# EAGLE design OS-Luefters (EAGLE 6.2)

## Sheet 1 of 3
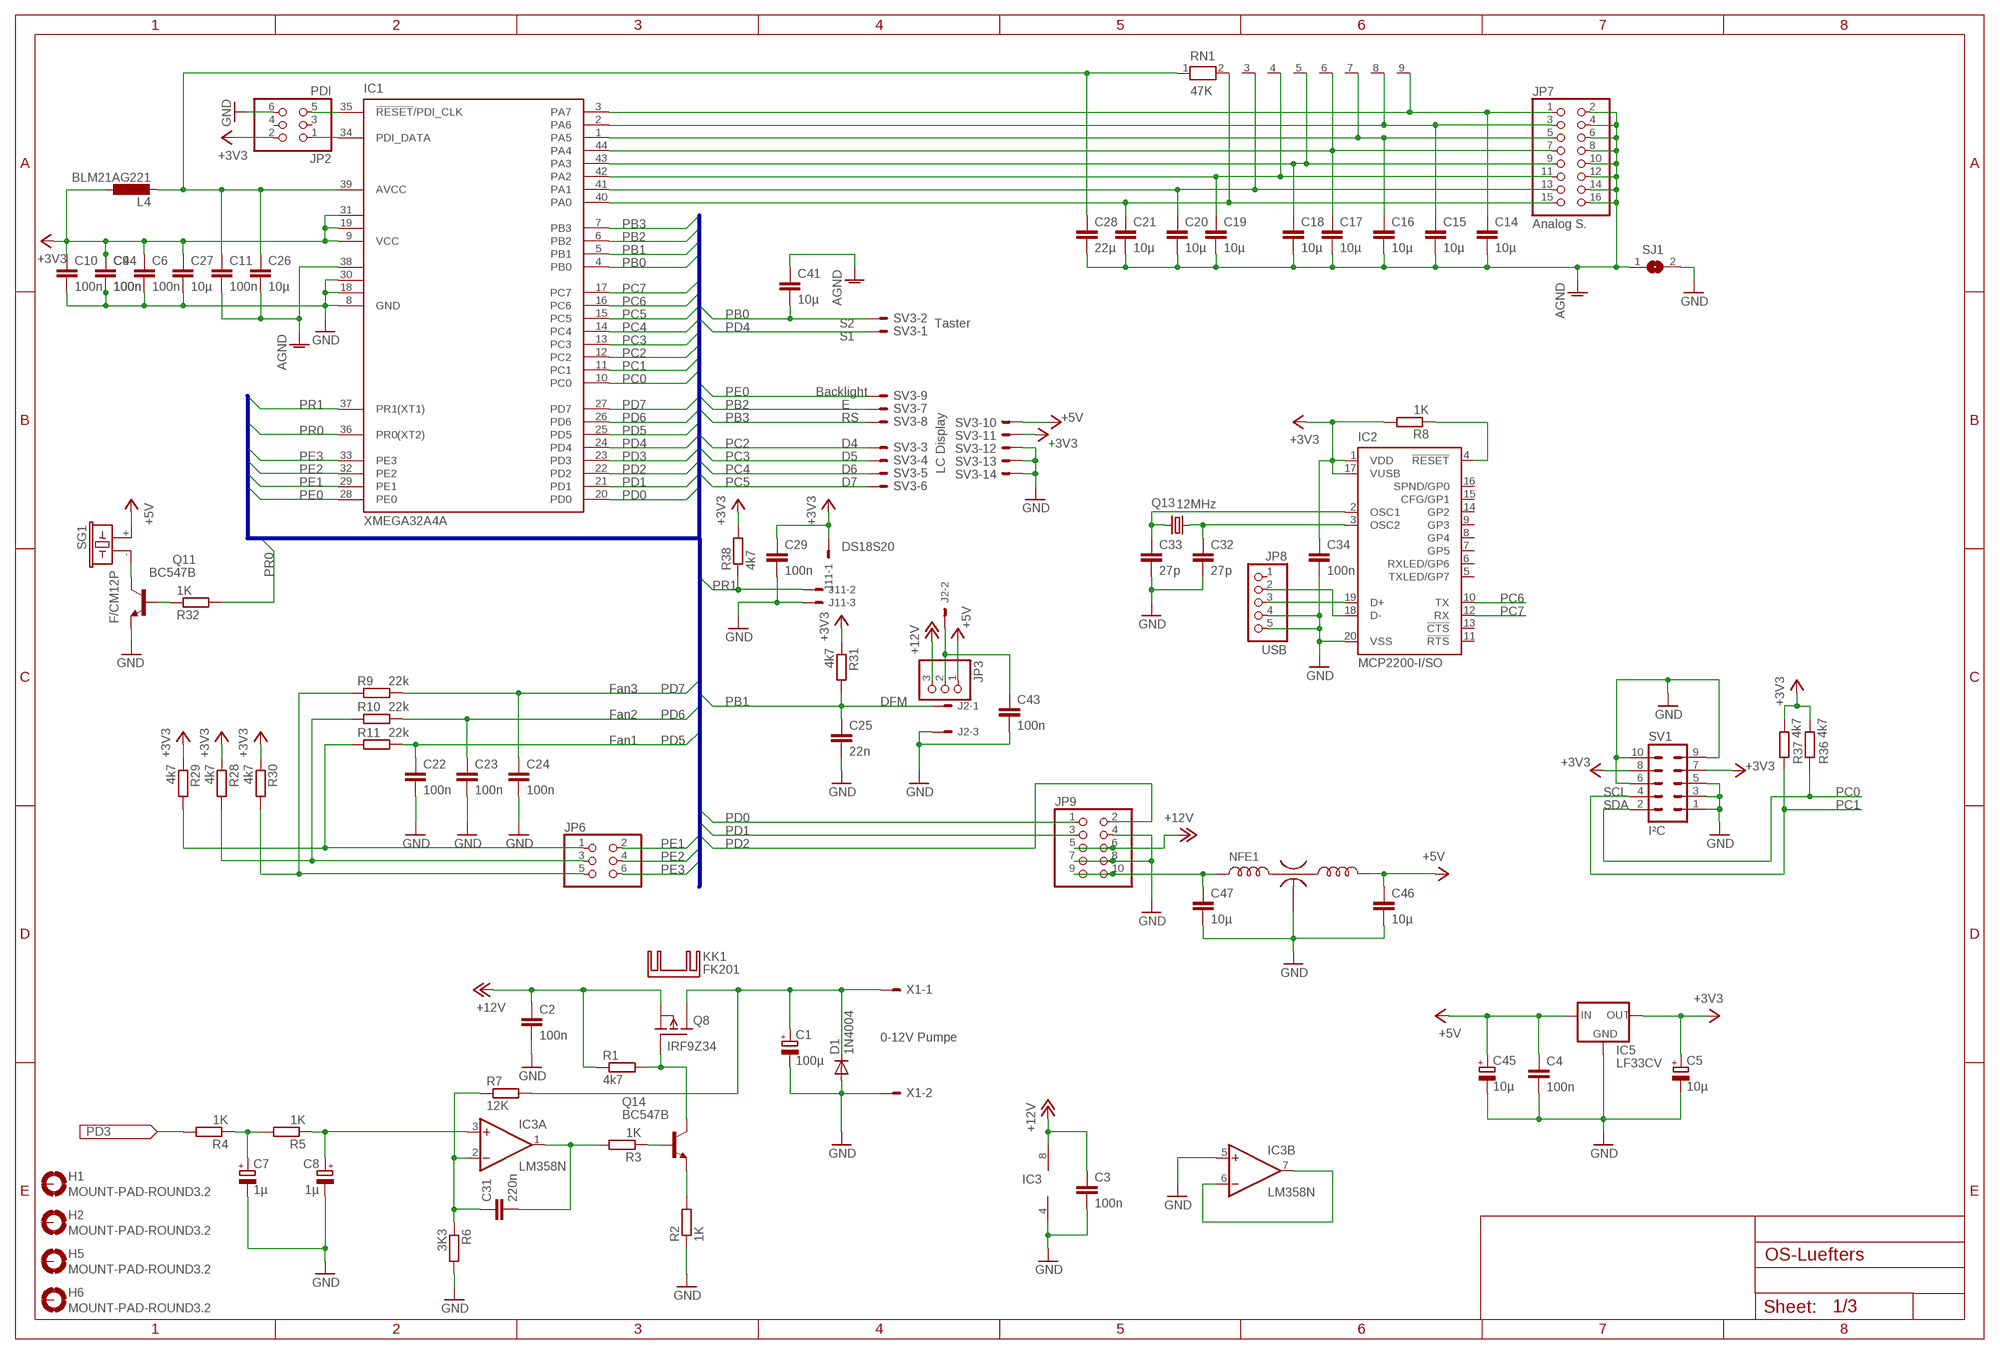
[diagram p0: schematic, sheet 1]

### Parts
C1  100µ  CPOL-EUE2.5-7  [E2,5-7]
C2  100n  C-EU050-025X075  [C050-025X075]
C3  100n  C-EU050-025X075  [C050-025X075]
C4  100n  C-EU050-025X075  [C050-025X075]
C5  10µ  CPOL-EUE2-5  [E2-5]
C6  100n  C-EUC0805K  [C0805K]
C7  1µ  CPOL-EUE2-5  [E2-5]
C8  1µ  CPOL-EUE2-5  [E2-5]
C9  100n  C-EUC0805K  [C0805K]
C10  100n  C-EUC0805K  [C0805K]
C11  100n  C-EUC0805K  [C0805K]
C14  10µ  C-EUC0805K  [C0805K]
C15  10µ  C-EUC0805K  [C0805K]
C16  10µ  C-EUC0805K  [C0805K]
C17  10µ  C-EUC0805K  [C0805K]
C18  10µ  C-EUC0805K  [C0805K]
C19  10µ  C-EUC0805K  [C0805K]
C20  10µ  C-EUC0805K  [C0805K]
C21  10µ  C-EUC0805K  [C0805K]
C22  100n  C-EU050-025X075  [C050-025X075]
C23  100n  C-EU050-025X075  [C050-025X075]
C24  100n  C-EU050-025X075  [C050-025X075]
C25  22n  C-EU050-025X075  [C050-025X075]
C26  10µ  C-EUC0805K  [C0805K]
C27  10µ  C-EUC0805K  [C0805K]
C28  22µ  C-EUC0805K  [C0805K]
C29  100n  C-EUC0805K  [C0805K]
C31  220n  C-EU050-025X075  [C050-025X075]
C32  27p  C-EU025-024X044  [C025-024X044]
C33  27p  C-EU025-024X044  [C025-024X044]
C34  100n  C-EU050-025X075  [C050-025X075]
C41  10µ  C-EUC0805K  [C0805K]
C43  100n  C-EU050-025X075  [C050-025X075]
C44  100n  C-EUC0805K  [C0805K]
C45  10µ  CPOL-EUE2-5  [E2-5]
C46  10µ  C-EUC0805K  [C0805K]
C47  10µ  C-EUC0805K  [C0805K]
D1  1N4004  [DO41-10]
H1  MOUNT-PAD-ROUND3.2  [3,2-PAD]
H2  MOUNT-PAD-ROUND3.2  [3,2-PAD]
H5  MOUNT-PAD-ROUND3.2  [3,2-PAD]
H6  MOUNT-PAD-ROUND3.2  [3,2-PAD]
IC1  XMEGA32A4A  XMEGA16A4A  [TQFP44]
IC2  MCP2200-I/SO  [SO-20W]
IC3  LM358N  [DIL08]
IC5  LF33CV  78XXL  [78XXL]
J2  22-05-7038-03  [7395-03]
J11  22-05-7038-03  [7395-03]
JP2  PDI  PINHD-2X3  [2X03]
JP3  PINHD-1X3/90  [1X03/90]
JP6  PINHD-2X3  [2X03]
JP7  Analog S.  PINHD-2X8/90  [2X08/90]
JP8  USB  PINHD-1X5/90  [1X05/90]
JP9  PINHD-2X5  [2X05]
KK1  FK201  [FK201]
L4  BLM21AG221  L-EUL2825P  [L2825P]
NFE1  NFE61  [2706]
Q8  IRF9Z34  IRF9530S  [TO220S]
Q11  BC547B  [TO92]
Q13  12MHz  CRYSTALHC49U-V  [HC49U-V]
Q14  BC547B  [TO92]
R1  4k7  R-EU_0207/10  [0207/10]
R2  1K  R-EU_0207/10  [0207/10]
R3  1K  R-EU_0207/10  [0207/10]
R4  1K  R-EU_0207/10  [0207/10]
R5  1K  R-EU_0207/10  [0207/10]
R6  3K3  R-EU_0207/10  [0207/10]
R7  12K  R-EU_0207/10  [0207/10]
R8  1K  R-EU_0207/10  [0207/10]
R9  22k  R-EU_0207/10  [0207/10]
R10  22k  R-EU_0207/10  [0207/10]
R11  22k  R-EU_0207/10  [0207/10]
R28  4k7  R-EU_0207/10  [0207/10]
R29  4k7  R-EU_0207/10  [0207/10]
R30  4k7  R-EU_0207/10  [0207/10]
R31  4k7  R-EU_0207/10  [0207/10]
R32  1K  R-EU_0207/10  [0207/10]
R36  4k7  R-EU_0207/10  [0207/10]
R37  4k7  R-EU_0207/10  [0207/10]
R38  4k7  R-EU_0207/10  [0207/10]
RN1  47K  RN08  [RN-9]
SG1  F/CM12P  [F/CM12P]
SJ1  SJ  [SJ]
SV1  I²C  ML10  [ML10]
SV3  ML14E  [ML14]
X1  AKL18X-02W-NO  [AKL182-02-NO]

### Nets
+3V3: C5.+ C6.1 C9.1 C10.1 C27.1 C29.1 C34.1 C44.1 IC1.9(VCC) IC1.19(VCC1) IC1.31(VCC2) IC2.1(VDD) IC2.17(VUSB) IC5.OUT J11.1 JP2.2 L4.1 R8.2 R28.1 R29.1 R30.1 R31.1 R36.2 R37.2 R38.2 SV1.7 SV1.8 SV3.11
+5V: C4.1 C45.+ C46.1 IC5.IN JP3.1 NFE1.OUT SG1.+ SV3.10
+12V: C2.1 C3.1 IC3.8(P:V+) JP3.3 JP9.5 JP9.6 Q8.3(S) R1.1
AGND: C11.2 C14.2 C15.2 C16.2 C17.2 C18.2 C19.2 C20.2 C21.2 C26.2 C28.2 C41.1 IC1.38(GND3) JP7.2 JP7.4 JP7.6 JP7.8 JP7.10 JP7.12 JP7.14 JP7.16 SJ1.1
GND: C1.- C2.2 C3.2 C4.2 C5.- C6.2 C7.- C8.- C9.2 C10.2 C22.2 C23.2 C24.2 C25.2 C27.2 C29.2 C32.2 C33.2 C34.2 C43.2 C44.2 C45.- C46.2 C47.2 D1.A IC1.8(GND) IC1.18(GND1) IC1.30(GND2) IC2.20(VSS) IC3.4(P:V-) IC3.5(B:+IN) IC5.GND J2.3 J11.3 JP2.6 JP8.4 JP8.5 JP9.4 JP9.7 JP9.8 NFE1.GND Q11.1(E) R2.1 R6.2 SJ1.2 SV1.1 SV1.3 SV1.5 SV1.6 SV1.9 SV1.10 SV3.12 SV3.13 SV3.14 X1.P$2
N$1: C1.+ D1.C Q8.2(D) R7.2 X1.P$1
N$2: IC3.6(B:-IN) IC3.7(B:OUT)
N$5: C43.1 J2.2 JP3.2
N$7: C7.+ R4.1 R5.2
N$10: Q8.1(G) Q14.3(C) R1.2
N$12: Q14.1(E) R2.2
N$13: C8.+ IC3.3(A:+IN) R5.1
N$17: IC1.34(PDI_DATA) JP2.1
N$23: IC1.35(!RESET!/PDI_CLK) JP2.5
N$33: C14.1 IC1.3(PA7) JP7.1 RN1.9
N$34: C15.1 IC1.2(PA6) JP7.3 RN1.8
N$35: C16.1 IC1.1(PA5) JP7.5 RN1.7
N$36: C17.1 IC1.44(PA4) JP7.7 RN1.6
N$37: C18.1 IC1.43(PA3) JP7.9 RN1.5
N$38: C19.1 IC1.42(PA2) JP7.11 RN1.4
N$39: C20.1 IC1.41(PA1) JP7.13 RN1.3
N$40: C21.1 IC1.40(PA0) JP7.15 RN1.2
N$42: Q11.3(C) SG1.-
N$43: Q11.2(B) R32.1
N$48: C47.1 JP9.9 JP9.10 NFE1.IN
N$49: Q14.2(B) R3.1
N$50: C31.2 IC3.1(A:OUT) R3.2
N$51: C31.1 IC3.2(A:-IN) R6.1 R7.1
N$71: C11.1 C26.1 C28.1 IC1.39(AVCC) L4.2 RN1.1
N$72: JP6.5 R9.1 R30.2
N$73: C32.1 IC2.3(OSC2) Q13.2
N$77: C33.1 IC2.2(OSC1) Q13.1
N$78: JP6.3 R10.1 R28.2
N$79: IC2.18(D-) JP8.2
N$80: IC2.19(D+) JP8.3
N$81: IC2.4(!RESET) R8.1
N$85: JP6.1 R11.1 R29.2
PB0: C41.2 IC1.4(PB0) SV3.2
PB1: C25.1 IC1.5(PB1) J2.1 R31.2
PB2: IC1.6(PB2) SV3.7
PB3: IC1.7(PB3) SV3.8
PC0: IC1.10(PC0) R36.1 SV1.2
PC1: IC1.11(PC1) R37.1 SV1.4
PC2: IC1.12(PC2) SV3.3
PC3: IC1.13(PC3) SV3.4
PC4: IC1.14(PC4) SV3.5
PC5: IC1.15(PC5) SV3.6
PC6: IC1.16(PC6) IC2.10(TX)
PC7: IC1.17(PC7) IC2.12(RX)
PD0: IC1.20(PD0) JP9.1
PD1: IC1.21(PD1) JP9.3
PD2: IC1.22(PD2) JP9.2
PD3: IC1.23(PD3) R4.2
PD4: IC1.24(PD4) SV3.1
PD5: C22.1 IC1.25(PD5) R11.2
PD6: C23.1 IC1.26(PD6) R10.2
PD7: C24.1 IC1.27(PD7) R9.2
PE0: IC1.28(PE0) SV3.9
PE1: IC1.29(PE1) JP6.2
PE2: IC1.32(PE2) JP6.4
PE3: IC1.33(PE3) JP6.6
PR0: IC1.36(PR0(XT2)) R32.2
PR1: IC1.37(PR1(XT1)) J11.2 R38.1
Unconnected: H1.B3,2(MOUNT) H2.B3,2(MOUNT) H5.B3,2(MOUNT) H6.B3,2(MOUNT) IC2.5(TXLED/GP7) IC2.6(RXLED/GP6) IC2.7(GP5) IC2.8(GP4) IC2.9(GP3) IC2.11(!RTS) IC2.13(!CTS) IC2.14(GP2) IC2.15(CFG/GP1) IC2.16(SPND/GP0) JP2.3 JP2.4 JP8.1

### Buses
B$1:PB[0..3],PC[0..7],PD[0..7],PE[0..3],PR[0..1]

### Notes on the sheet
- S2 | Taster
- S1
- Backlight
- E
- RS
- D4
- D5
- D6 | LC Display
- D7
- DS18S20
- Fan3
- DFM
- Fan2
- Fan1
- SCL
- SDA
- 0-12V Pumpe
- IC3

## Sheet 2 of 3
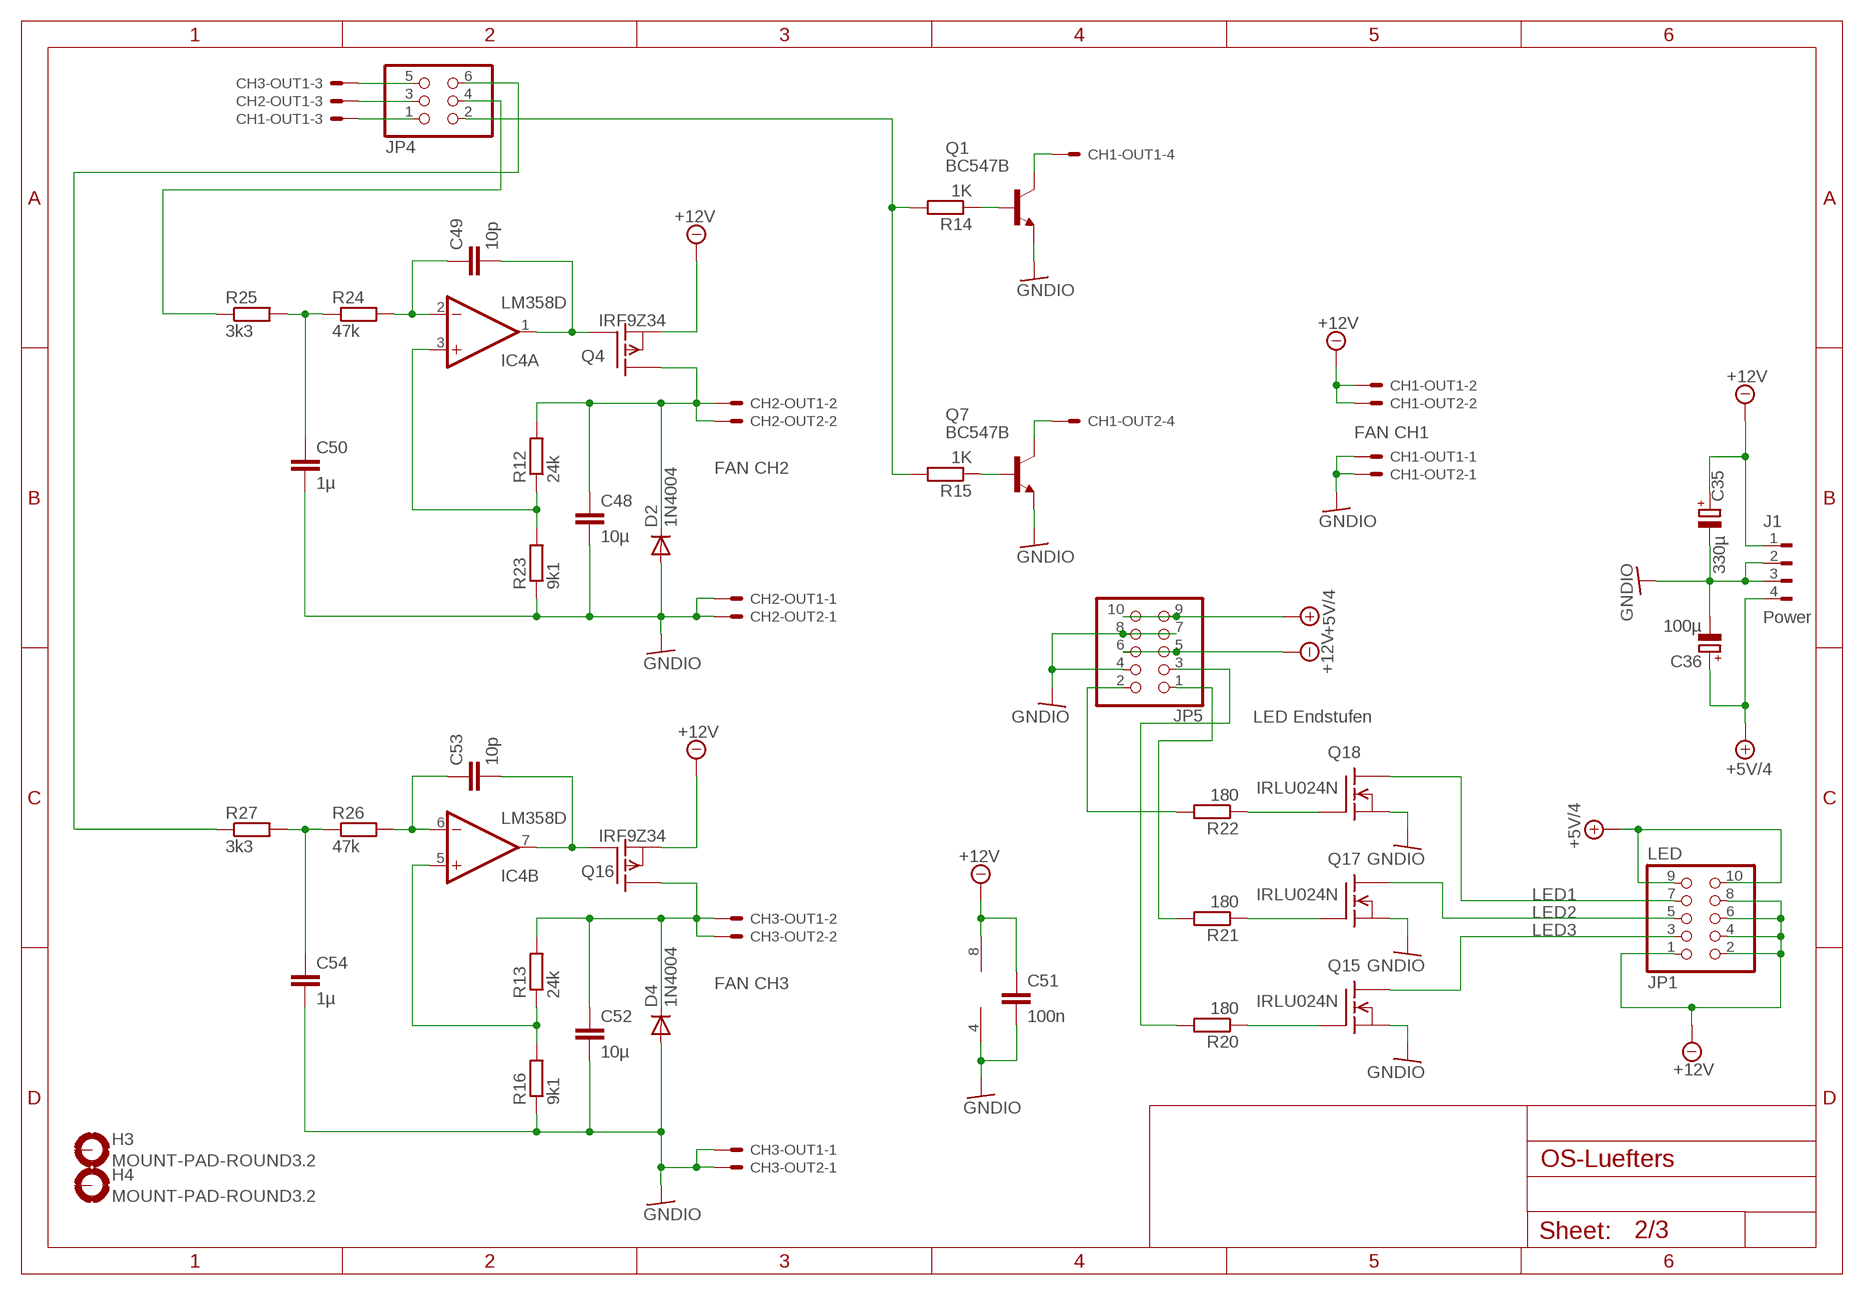
[diagram p1: schematic, sheet 2]

### Parts
C35  330µ  CPOL-EUE3.5-8  [E3,5-8]
C36  100µ  CPOL-EUE2.5-7  [E2,5-7]
C48  10µ  C-EUC0805K  [C0805K]
C49  10p  C-EUC0805K  [C0805K]
C50  1µ  C-EUC0805K  [C0805K]
C51  100n  C-EUC0805K  [C0805K]
C52  10µ  C-EUC0805K  [C0805K]
C53  10p  C-EUC0805K  [C0805K]
C54  1µ  C-EUC0805K  [C0805K]
CH1-OUT1  22-FAN-INTEL-04  [7395-04INTEL]
CH1-OUT2  22-FAN-INTEL-04  [7395-04INTEL]
CH2-OUT1  22-FAN-03  [7395-03MIRROR]
CH2-OUT2  22-FAN-03  [7395-03MIRROR]
CH3-OUT1  22-FAN-03  [7395-03MIRROR]
CH3-OUT2  22-FAN-03  [7395-03MIRROR]
D2  1N4004  [DO41-10]
D4  1N4004  [DO41-10]
H3  MOUNT-PAD-ROUND3.2  [3,2-PAD]
H4  MOUNT-PAD-ROUND3.2  [3,2-PAD]
IC4  LM358D  [SO08]
J1  Power  FLOP-4W827001  [827001]
JP1  LED  PINHD-2X5/90  [2X05/90]
JP4  PINHD-2X3  [2X03]
JP5  PINHD-2X5  [2X05]
Q1  BC547B  [TO92]
Q4  IRF9Z34  IRF9530H  [TO220]
Q7  BC547B  [TO92]
Q15  IRLU024N  IRLU024NS  [I-PAK_TO251AS]
Q16  IRF9Z34  IRF9530H  [TO220]
Q17  IRLU024N  IRLU024NS  [I-PAK_TO251AS]
Q18  IRLU024N  IRLU024NS  [I-PAK_TO251AS]
R12  24k  R-EU_M1206  [M1206]
R13  24k  R-EU_M1206  [M1206]
R14  1K  R-EU_M1206  [M1206]
R15  1K  R-EU_M1206  [M1206]
R16  9k1  R-EU_M1206  [M1206]
R20  180  R-EU_0207/10  [0207/10]
R21  180  R-EU_0207/10  [0207/10]
R22  180  R-EU_0207/10  [0207/10]
R23  9k1  R-EU_M1206  [M1206]
R24  47k  R-EU_M0805  [M0805]
R25  3k3  R-EU_M0805  [M0805]
R26  47k  R-EU_M0805  [M0805]
R27  3k3  R-EU_M0805  [M0805]

### Nets
+5V/4: C36.+ J1.4 JP1.9 JP1.10 JP5.9 JP5.10
-12V: C35.+ C51.1 CH1-OUT1.2 CH1-OUT2.2 IC4.8(P:V+) J1.1 JP1.1 JP1.2 JP1.4 JP1.6 JP1.8 JP5.5 JP5.6 Q4.3(S) Q16.3(S) ; supply symbol labelled +12V
GNDIO: C35.- C36.- C48.2 C50.2 C51.2 C52.2 C54.2 CH1-OUT1.1 CH1-OUT2.1 CH2-OUT1.1 CH2-OUT2.1 CH3-OUT1.1 CH3-OUT2.1 D2.A D4.A IC4.4(P:V-) J1.2 J1.3 JP5.4 JP5.7 JP5.8 Q1.1(E) Q7.1(E) Q15.3(S) Q17.3(S) Q18.3(S) R16.1 R23.1
LED1: JP1.7 Q18.2(D)
LED2: JP1.5 Q17.2(D)
LED3: JP1.3 Q15.2(D)
N$3: C52.1 CH3-OUT1.2 CH3-OUT2.2 D4.C Q16.2(D) R13.2
N$4: JP4.6 R27.1
N$6: IC4.3(A:+IN) R12.1 R23.2
N$8: C49.2 IC4.1(A:OUT) Q4.1(G)
N$9: JP4.2 R14.2 R15.2
N$11: JP4.4 R25.1
N$14: CH2-OUT1.3 JP4.3
N$15: CH3-OUT1.3 JP4.5
N$16: IC4.5(B:+IN) R13.1 R16.2
N$18: C49.1 IC4.2(A:-IN) R24.2
N$19: Q1.2(B) R14.1
N$20: C48.1 CH2-OUT1.2 CH2-OUT2.2 D2.C Q4.2(D) R12.2
N$21: Q7.2(B) R15.1
N$22: CH1-OUT1.4 Q1.3(C)
N$24: C53.2 IC4.7(B:OUT) Q16.1(G)
N$25: CH1-OUT2.4 Q7.3(C)
N$41: CH1-OUT1.3 JP4.1
N$45: JP5.2 R22.2
N$46: JP5.1 R21.2
N$47: JP5.3 R20.2
N$52: C50.1 R24.1 R25.2
N$53: C53.1 IC4.6(B:-IN) R26.2
N$54: C54.1 R26.1 R27.2
N$82: Q15.1(G) R20.1
N$83: Q17.1(G) R21.1
N$84: Q18.1(G) R22.1
Unconnected: CH1-OUT2.3 CH2-OUT2.3 CH3-OUT2.3 H3.B3,2(MOUNT) H4.B3,2(MOUNT)

### Notes on the sheet
- FAN CH1
- FAN CH2
- LED Endstufen
- FAN CH3

## Sheet 3 of 3
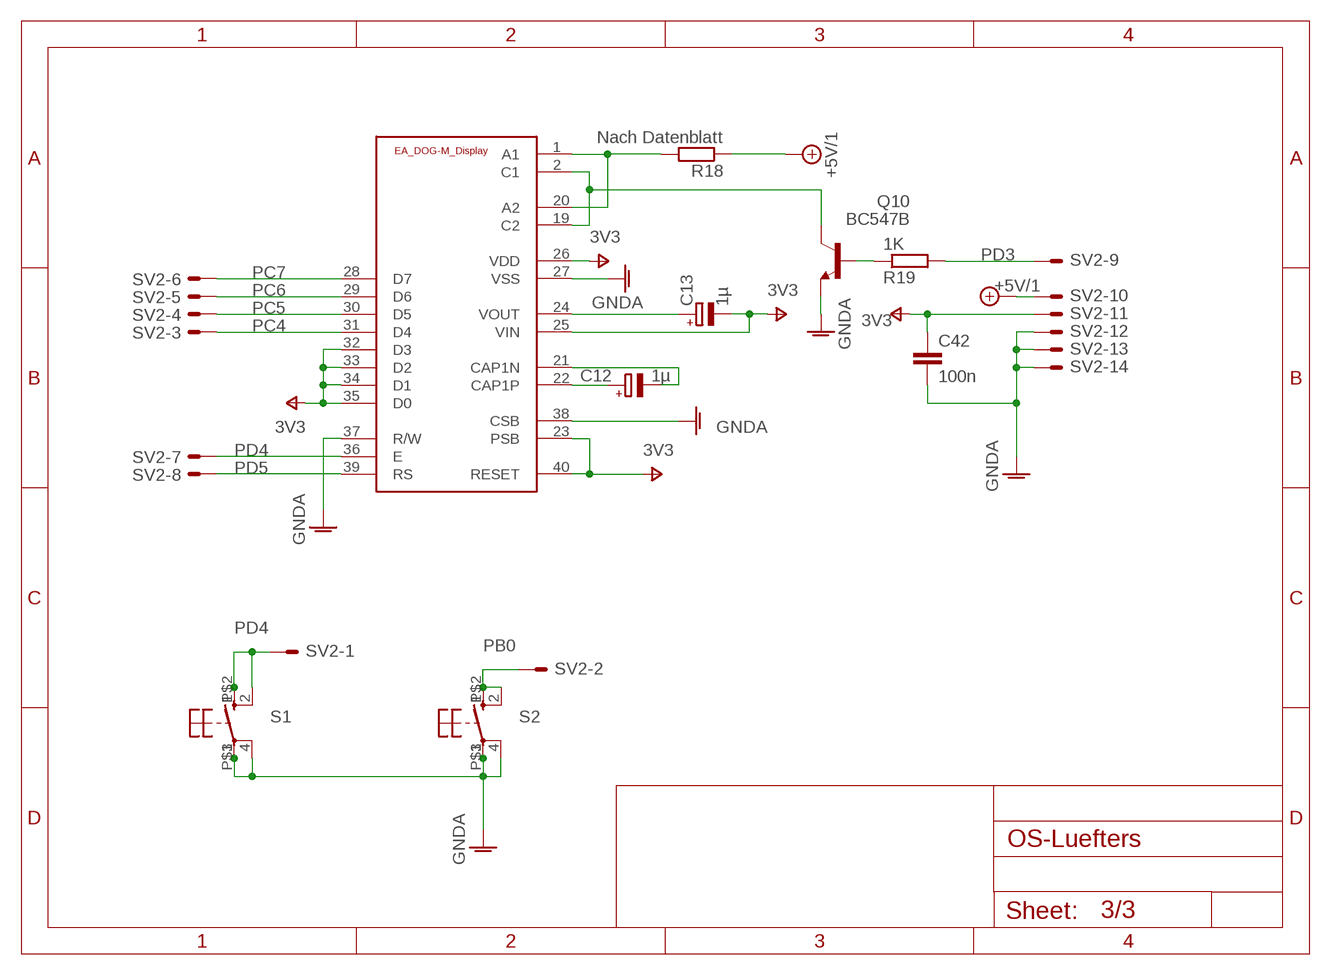
[diagram p2: schematic, sheet 3]

### Parts
C12  1µ  CPOL-EUE2-5  [E2-5]
C13  1µ  CPOL-EUE2-5  [E2-5]
C42  100n  C-EUC0805K  [C0805K]
Q10  BC547B  [TO92]
R18  Nach Datenblatt  R-EU_0207/10  [0207/10]
R19  1K  R-EU_0207/10  [0207/10]
S1  10-XX  [B3F-10XX]
S2  10-XX  [B3F-10XX]
S3  MTG1/2"  [MTG1/2"]
S4  MTG1/2"  [MTG1/2"]
SV2  ML14E  [ML14]
U$1  EA_DOG-M_DISPLAY  [E_DOG-M_DISPLAY]

### Nets
+5V/1: R18.1 SV2.10
GNDA: C42.2 Q10.1(E) S1.3(P) S1.4(P1) S2.3(P) S2.4(P1) S3.P$1(P) S4.P$1(P) SV2.12 SV2.13 SV2.14 U$1.27(VSS) U$1.37(R/W) U$1.38(CSB)
N$27: R18.2 U$1.1(A1) U$1.20(A2)
N$28: Q10.3(C) U$1.2(C1) U$1.19(C2)
N$29: Q10.2(B) R19.1
N$30: C12.+ U$1.22(CAP1P)
N$31: C12.- U$1.21(CAP1N)
N$32: C13.+ U$1.24(VOUT)
N$62: S1.1(S) S1.2(S1) S3.P$2(S) SV2.1
N$63: S2.1(S) S2.2(S1) S4.P$2(S) SV2.2
N$64: SV2.3 U$1.31(D4)
N$65: SV2.4 U$1.30(D5)
N$66: SV2.5 U$1.29(D6)
N$67: SV2.6 U$1.28(D7)
N$68: SV2.7 U$1.36(E)
N$69: SV2.8 U$1.39(RS)
N$70: R19.2 SV2.9
V+: C13.- C42.1 SV2.11 U$1.23(PSB) U$1.25(VIN) U$1.26(VDD) U$1.32(D3) U$1.33(D2) U$1.34(D1) U$1.35(D0) U$1.40(RESET) ; supply symbol labelled 3V3

### Notes on the sheet
- PD3
- PC7
- PC6
- PC5
- PC4
- PD4
- PD5
- PD4
- PB0
- S1 | S2

## Library data of the parts
C1 C5 C7 C8 C12 C13 C35 C36 C45 = rcl:CPOL-EU: POLARIZED CAPACITOR, European symbol
C2-C4 C6 C9-C11 C14-C29 C31-C34 C41-C44 C46-C54 = rcl:C-EU: CAPACITOR, European symbol
CH1-OUT1 CH1-OUT2 = con-molex:22-?-04: CONNECTOR wire to board 2.54 mm (.1 inch) pitch header
CH2-OUT1 CH2-OUT2 CH3-OUT1 CH3-OUT2 J2 J11 = con-molex:22-?-03: CONNECTOR wire to board 2.54 mm (.1 inch) pitch header
D1 D2 D4 = diode:1N4004: DIODE general purpose rectifier, 1 A
H1-H6 = holes:MOUNT-PAD-ROUND: MOUNTING PAD, round
IC1 = atmel:XMEGA16A4: MICROCONTROLLER Features High-performance, Low-power 8/16-bit AVR XMEGA Microcontroller Non-Volatile Program and Data Memories - 16 KB - 128 KB of In-System Self-Programmable Flash - 4 KB - 8 KB Boot Code Section with Independent Lock Bits - 1 KB - 2 KB EEPROM - 2 KB - 8 KB Internal SRAM Peripheral Features - Four-channel DMA Controller with support for external requests - Eight-channel Event System - Five 16-bit Timer/Counters Three Timer/Counters with 4 Output Compare or Input Capture channels Two Timer/Counters with 2 Output Compare or Input Capture channels High-Resolution Extensions on all Timer/Counters Advanced Waveform Extension on one Timer/Counter - Five USARTs IrDA Extension on one USART - Two Two-Wire Interfaces with dual address match (I2C and SMBus compatible) - Two SPIs (Serial Peripheral Interfaces) peripherals - AES and DES Crypto Engine - 16-bit Real Time Counter with Separate Oscillator - One Twelve-channel, 12-bit, 2 Msps Analog to Digital Converter - One Two-channel, 12-bit, 1 Msps Digital to Analog Converter - Two Analog Comparators with Window compare function - External Interrupts on all General Purpose I/O pins - Programmable Watchdog Timer with Separate On-chip Ultra Low Power Oscillator Special Microcontroller Features - Power-on Reset and Programmable Brown-out Detection - Internal and External Clock Options with PLL - Programmable Multi-level Interrupt Controller - Sleep Modes: Idle, Power-down, Standby, Power-save, Extended Standby - Advanced Programming, Test and Debugging Interfaces PDI (Program and Debug Interface) for programming, test and debugging I/O and Packages - 34 Programmable I/O Lines - 44 - lead TQFP - 44 - pad VQFN/QFN - 49 - ball VFBGA Operating Voltage - 1.6 - 3.6V Speed performance - 0 - 12 MHz @ 1.6 - 3.6V - 0 - 32 MHz @ 2.7 - 3.6V Drawn by Dipl.-Ing. (FH) Robert Siegler Created: 27.05.09
IC2 = microchip:MCP2200: USB 2.0 to UART Converter with GPIO
IC3 IC4 = linear:LM358: OP AMP also LM158; LM258; LM2904 Source: http://cache.national.com/ds/LM/LM158.pdf
IC5 = v-reg:78XXL: VOLTAGE REGULATOR
J1 = con-amp:FLOP-4W: MATE N-LOCK Floppy / HDD conector Distributor: Bürklin 71F972
JP1 JP5 JP9 = pinhead:PINHD-2X5: PIN HEADER
JP2 JP4 JP6 = pinhead:PINHD-2X3: PIN HEADER
JP3 = pinhead:PINHD-1X3: PIN HEADER
JP7 = pinhead:PINHD-2X8: PIN HEADER
JP8 = pinhead:PINHD-1X5: PIN HEADER
KK1 = heatsink:FK201: HEATSINK manufacturer Fischer/distributor Buerklin
L4 = rcl:L-EU: INDUCTOR, European symbol
NFE1 = muratanfe61:NFE61: SMD Entstörfilter (T-Filter) T-Filter zur Entstörung von Versorgungspannungen mit integrietem Ferriten zur Unterdrückung unerwünschter Schwingungen. Spannung DC: 50V Strom: 2,0A Toleranz: +/- 30%
Q1 Q7 Q10 Q11 Q14 = transistor-npn:BC547*: NPN Transistor
Q4 Q8 Q16 = transistor-fet:IRF9530: P-Channel Enhancement MOSFET (HEXFET); -100V; -12A; 0,3Ohm
Q13 = crystal:CRYSTAL: CRYSTAL
Q15 Q17 Q18 = transistor-fet:IRLU024N
R1-R16 R18-R32 R36-R38 = rcl:R-EU_: RESISTOR, European symbol
RN1 = resistor-net:RN08: RESISTOR NETWORK
S1 S2 = switch-omron:10-XX: OMRON SWITCH
S3 S4 = switch-misc:MTG1/2"
SG1 = buzzer:F/CM12P: BUZZER Source: Buerklin
SJ1 = jumper:SJ: SMD solder JUMPER
SV1 = con-harting-ml:ML10: HARTING
SV2 SV3 = con-harting-ml:ML14?E: HARTING
U$1 = display_ea_dog-m:EA_DOG-M_DISPLAY
X1 = con-riacon AKL:AKL18X-02: Riacon AKL18X Steckverbinder 2-Pol Grid = 3,5mm

## Board
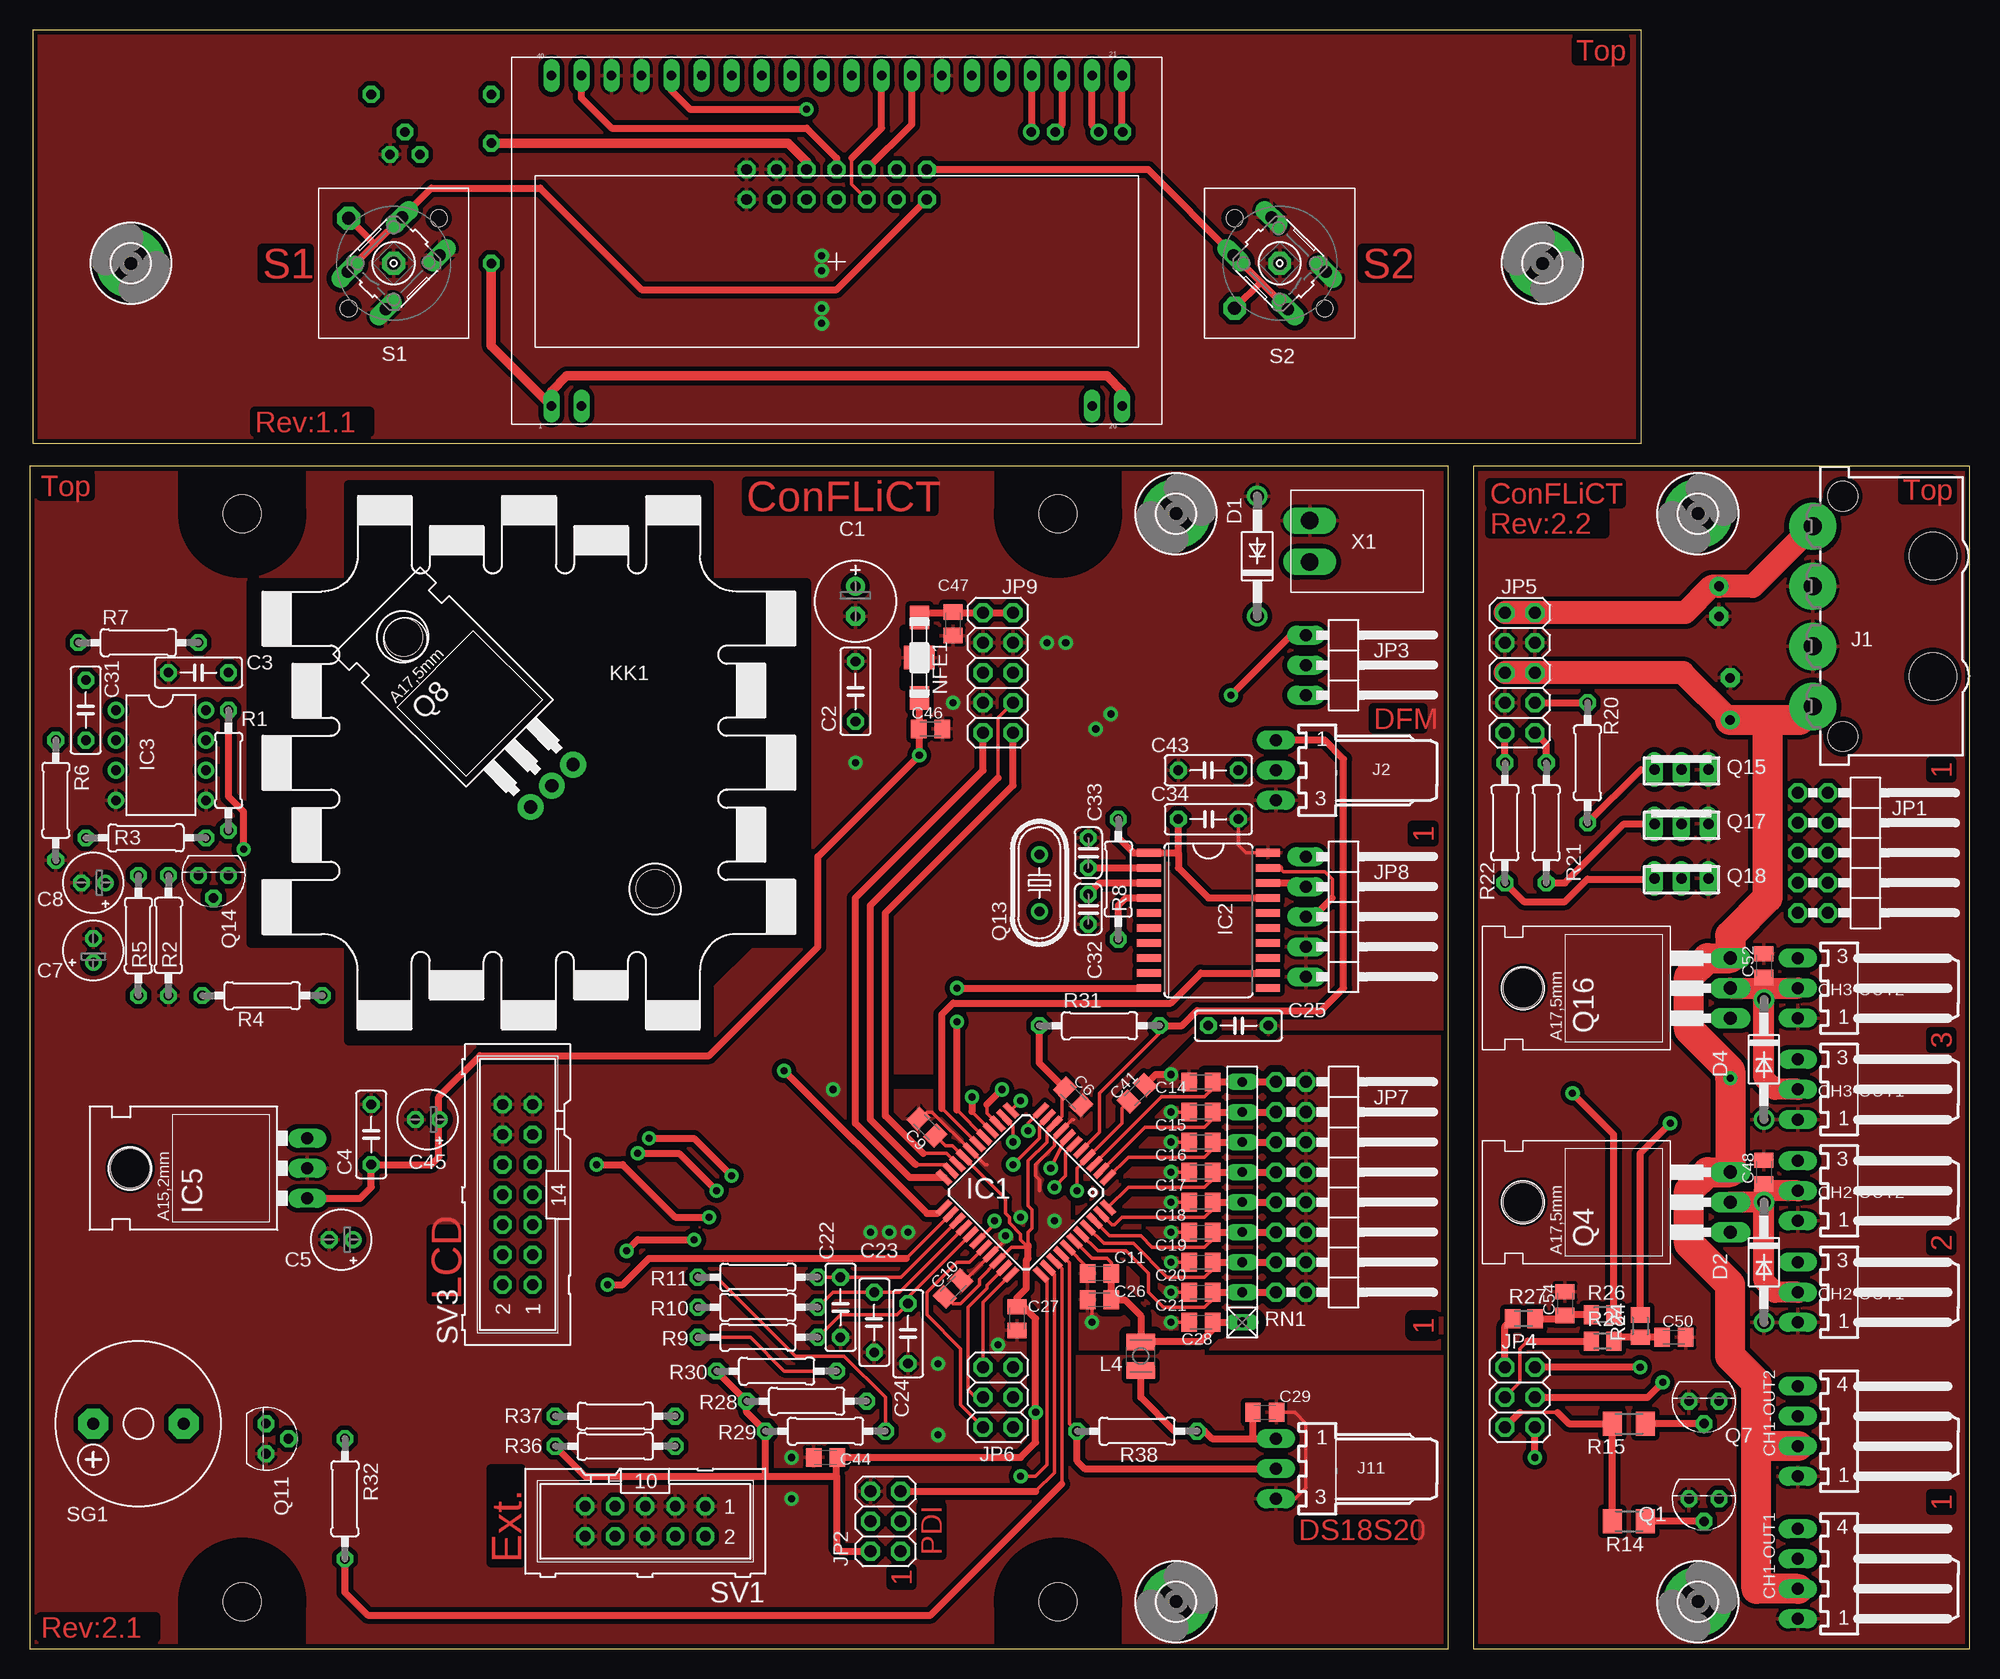
[diagram p3: board, top side]
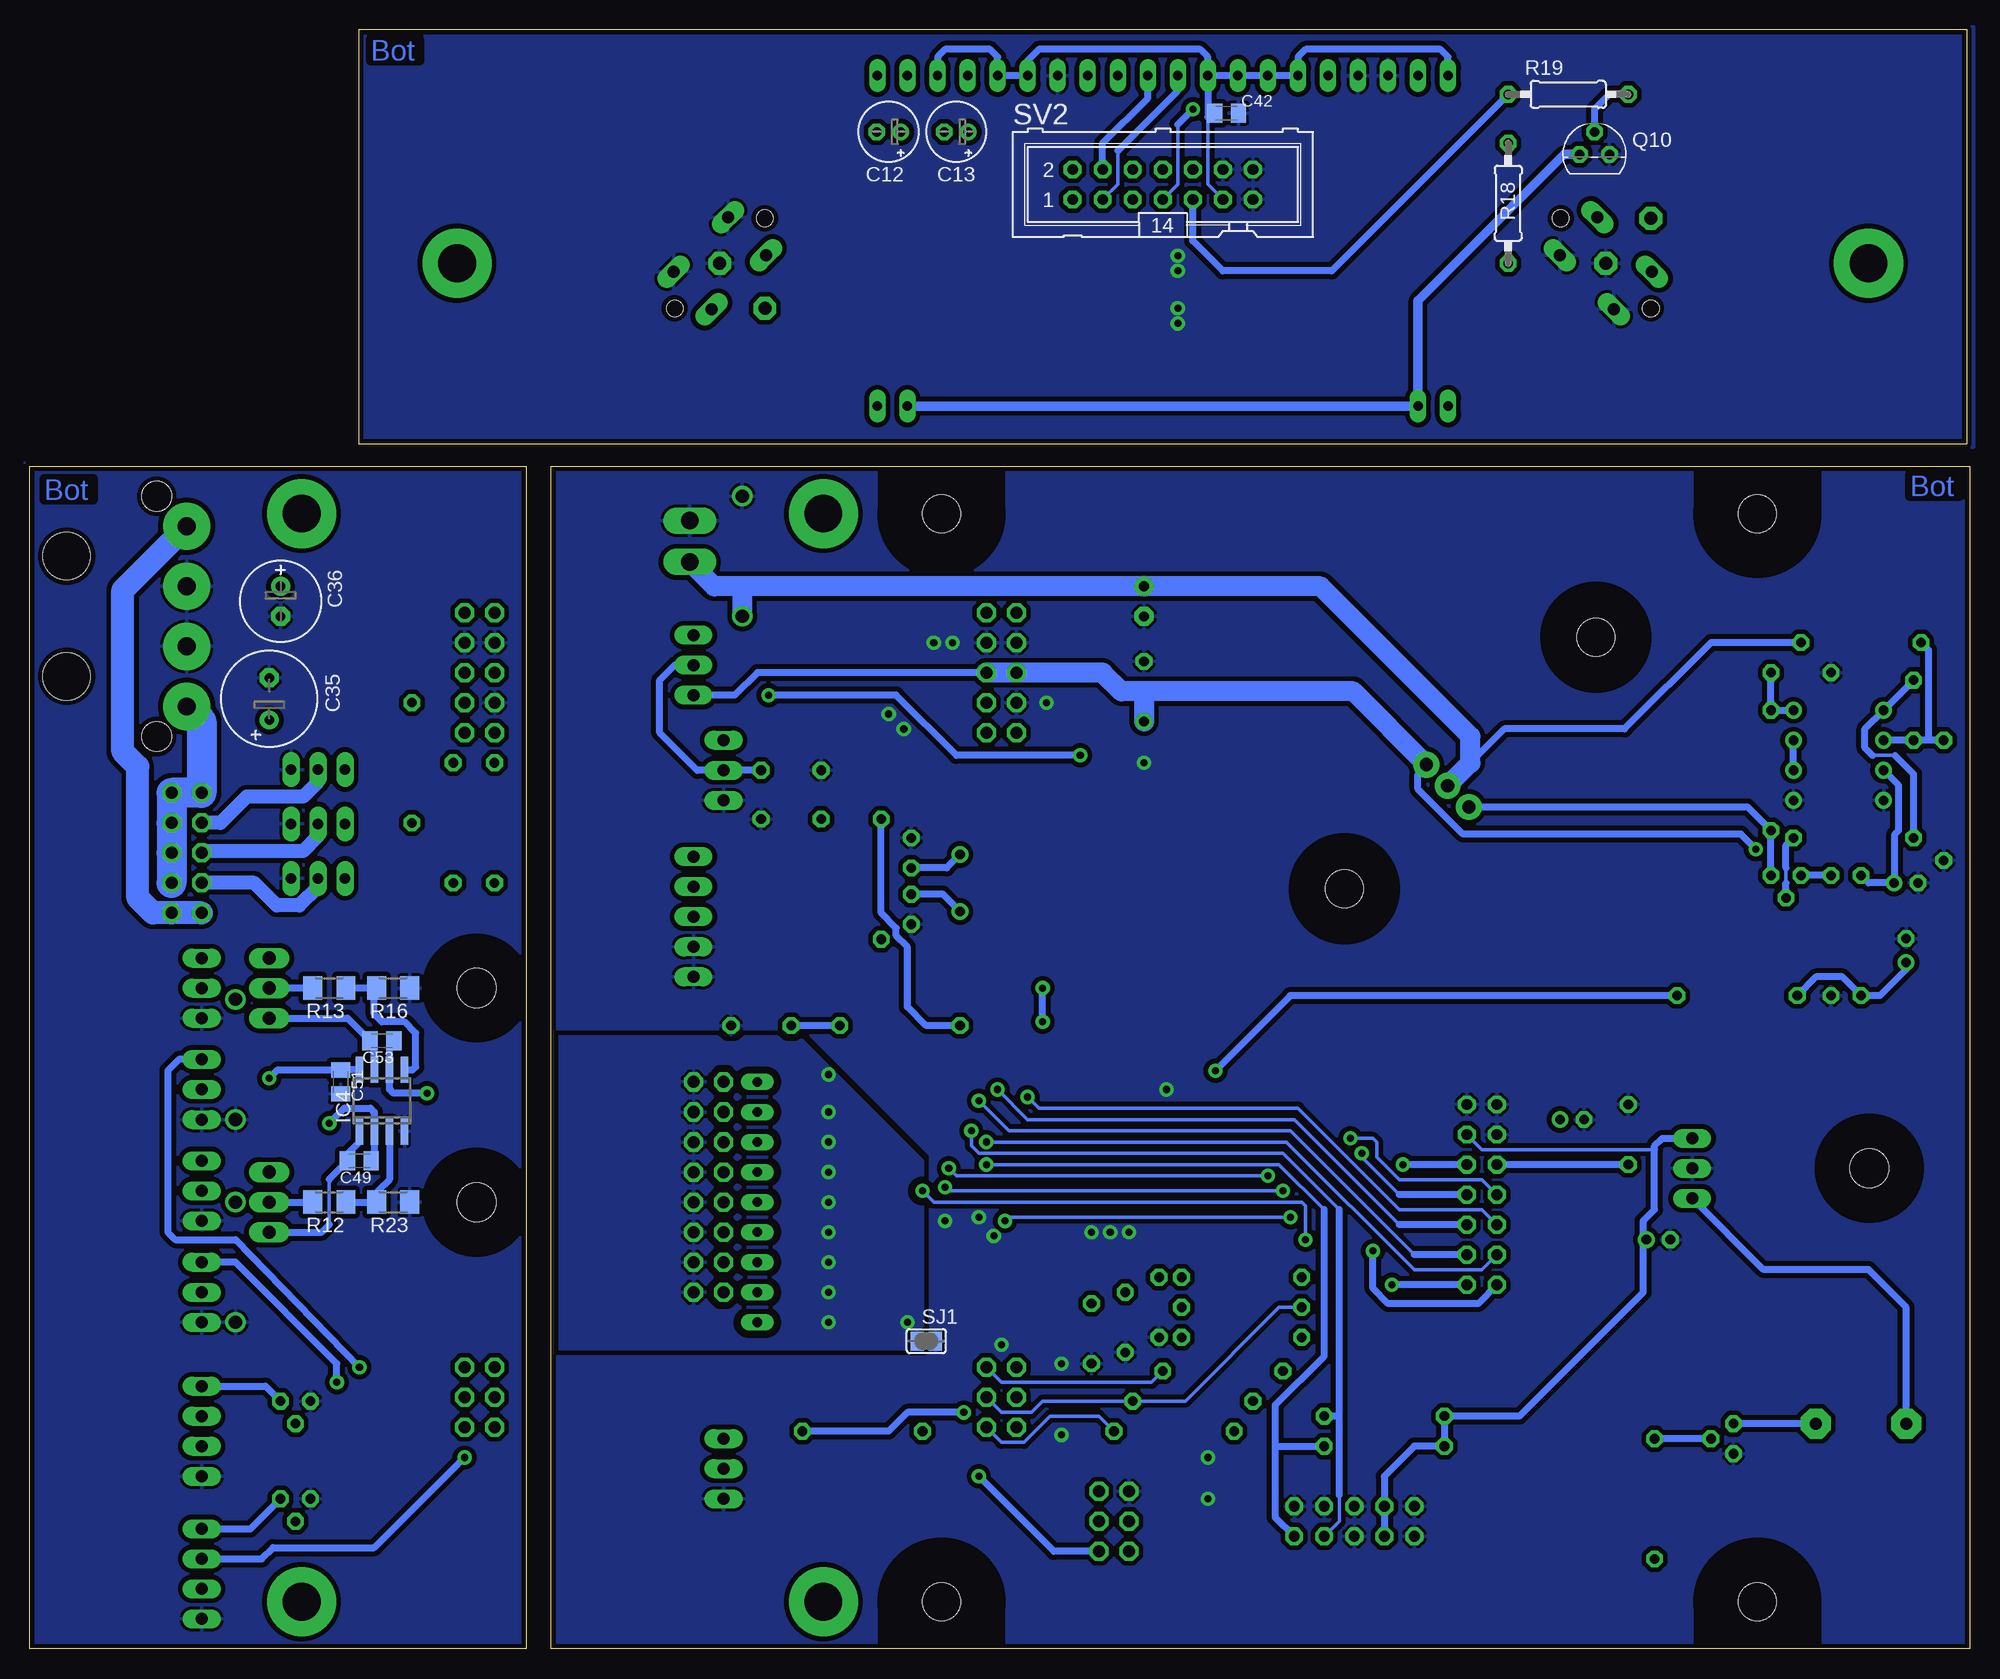
[diagram p4: board, bottom side, seen from below]

Size 164.1 x 136.92 mm. Coordinates in mm from the lower left corner, seen from the top.
Outline: 0,100 0,0 120,0 120,100 0,100
Outline: 122.1,0 164.1,0 164.1,100 122.1,100 122.1,0
Outline: 136.26,136.92 136.26,101.92 0.26,101.92 0.26,136.92 136.26,136.92
Copper layers (1*16): Top 0.035mm / dielectric 1.5mm / Bottom 0.035mm
Design rules: minimum track width 0.2mm, minimum drill 0.4mm, track to track 0.2mm, track to pad 0.2mm, pad to pad 0.2mm, via to via 0.2mm, smd to smd 0.2mm, copper to edge 0.2mm, drill to drill 8mil, minimum pad ring 0.3mm, minimum via ring 0.3mm, stop-mask expansion 4mil, vias tented up to drill 0mil, thermal gap 10mil
Holes 3.2 mm at 17.97,4 86.97,4 86.97,96 17.97,96 52.9,64.26 31.63,85.54
tRestrict: area 13,-1 to 23,9; area 82,-1 to 92,9; area 13,91 to 23,101; area 82,91 to 92,101; area 82,0 to 92,4; area 13,0 to 23,4; area 82,96 to 92,100; area 13,96 to 23,100; area 57.5,56.2 to 61,59.7; 1 lines
bRestrict: area 82,91 to 92,101; area 13,91 to 23,101; area 13,-1 to 23,9; area 82,-1 to 92,9; area 49.7,61.1 to 56.1,67.5; area 28.4,82.3 to 34.8,88.7; area 82,96 to 92,100; area 13,96 to 23,100; area 13,0 to 23,4; area 82,0 to 92,4

### Footprints (pad centres in the part's own frame; a part is rotated, then mirrored left to right if it is on the bottom)
E2,5-7 = drill 0.813 pad 1.6: + -1.27,0 | drill 0.813 pad 1.6 octagon: - 1.27,0
C050-025X075 = drill 0.813 octagon: 1 -2.54,0; 2 2.54,0
E2-5 = drill 0.813 pad 1.27: + -1.016,0 | drill 0.813 pad 1.27 octagon: - 1.016,0
C0805K = smd 1.3 x 1.6: 1 -1,0; 2 1,0
C025-024X044 = drill 0.813 octagon: 1 -1.27,0; 2 1.27,0
E3,5-8 = drill 0.813 pad 1.6: + -1.778,0 | drill 0.813 pad 1.6 octagon: - 1.778,0
7395-04INTEL = drill 1.016 long: 1 -3.81,0; 2 -1.27,0; 3 1.27,0; 4 3.81,0
7395-03MIRROR = drill 1.016 long: 1 -2.54,0; 2 0,0; 3 2.54,0
DO41-10 = drill 1.118: A 5.08,0; C -5.08,0
3,2-PAD = drill 3.2 pad 5.842: B3,2 0,0
TQFP44 = smd 1.5 x 0.5: 1 -5.8,4; 2 -5.8,3.2; 3 -5.8,2.4; 4 -5.8,1.6; 5 -5.8,0.8; 6 -5.8,0; 7 -5.8,-0.8; 8 -5.8,-1.6; 9 -5.8,-2.4; 10 -5.8,-3.2; 11 -5.8,-4; 23 5.8,-4; 24 5.8,-3.2; 25 5.8,-2.4; 26 5.8,-1.6; 27 5.8,-0.8; 28 5.8,0; 29 5.8,0.8; 30 5.8,1.6; 31 5.8,2.4; 32 5.8,3.2; 33 5.8,4 | smd 0.5 x 1.5: 12 -4,-5.8; 13 -3.2,-5.8; 14 -2.4,-5.8; 15 -1.6,-5.8; 16 -0.8,-5.8; 17 0,-5.8; 18 0.8,-5.8; 19 1.6,-5.8; 20 2.4,-5.8; 21 3.2,-5.8; 22 4,-5.8; 34 4,5.8; 35 3.2,5.8; 36 2.4,5.8; 37 1.6,5.8; 38 0.8,5.8; 39 0,5.8; 40 -0.8,5.8; 41 -1.6,5.8; 42 -2.4,5.8; 43 -3.2,5.8; 44 -4,5.8
SO-20W = smd 0.66 x 2.032: 1 -5.715,-5.029; 2 -4.445,-5.029; 3 -3.175,-5.029; 4 -1.905,-5.029; 5 -0.635,-5.029; 6 0.635,-5.029; 7 1.905,-5.029; 8 3.175,-5.029; 9 4.445,-5.029; 10 5.715,-5.029; 11 5.715,5.029; 12 4.445,5.029; 13 3.175,5.029; 14 1.905,5.029; 15 0.635,5.029; 16 -0.635,5.029; 17 -1.905,5.029; 18 -3.175,5.029; 19 -4.445,5.029; 20 -5.715,5.029
DIL08 = drill 0.813 pad 1.27: 1 -3.81,-3.81; 2 -1.27,-3.81; 3 1.27,-3.81; 4 3.81,-3.81; 5 3.81,3.81; 6 1.27,3.81; 7 -1.27,3.81; 8 -3.81,3.81
SO08 = smd 0.6 x 2.2: 1 -1.905,-2.6; 2 -0.635,-2.6; 3 0.635,-2.6; 4 1.905,-2.6; 5 1.905,2.6; 6 0.635,2.6; 7 -0.635,2.6; 8 -1.905,2.6
78XXL = drill 1.016 long: GND 0,-3.81; IN -2.54,-3.81; OUT 2.54,-3.81 | hole 3.302: 0,11.176
827001 = drill 1.5 pad 4: 1 -7.62,0; 2 -2.54,0; 3 2.54,0; 4 7.62,0 | hole 4: 5.08,-10.16; -5.08,-10.16 | hole 2.5: 10.16,-2.54; -10.16,-2.54
7395-03 = drill 1.016 long: 1 2.54,0; 2 0,0; 3 -2.54,0
2X05/90 = drill 1.016 octagon: 1 -5.08,-6.35; 2 -5.08,-3.81; 3 -2.54,-6.35; 4 -2.54,-3.81; 5 0,-6.35; 6 0,-3.81; 7 2.54,-6.35; 8 2.54,-3.81; 9 5.08,-6.35; 10 5.08,-3.81
2X03 = drill 1.016 octagon: 1 -2.54,-1.27; 2 -2.54,1.27; 3 0,-1.27; 4 0,1.27; 5 2.54,-1.27; 6 2.54,1.27
1X03/90 = drill 1.016 long: 1 -2.54,-3.81; 2 0,-3.81; 3 2.54,-3.81
2X05 = drill 1.016 octagon: 1 -5.08,-1.27; 2 -5.08,1.27; 3 -2.54,-1.27; 4 -2.54,1.27; 5 0,-1.27; 6 0,1.27; 7 2.54,-1.27; 8 2.54,1.27; 9 5.08,-1.27; 10 5.08,1.27
2X08/90 = drill 1.016 octagon: 1 -8.89,-6.35; 2 -8.89,-3.81; 3 -6.35,-6.35; 4 -6.35,-3.81; 5 -3.81,-6.35; 6 -3.81,-3.81; 7 -1.27,-6.35; 8 -1.27,-3.81; 9 1.27,-6.35; 10 1.27,-3.81; 11 3.81,-6.35; 12 3.81,-3.81; 13 6.35,-6.35; 14 6.35,-3.81; 15 8.89,-6.35; 16 8.89,-3.81
1X05/90 = drill 1.016 long: 1 -5.08,-3.81; 2 -2.54,-3.81; 3 0,-3.81; 4 2.54,-3.81; 5 5.08,-3.81
L2825P = smd 1.4 x 2.4: 1 -1.2,0; 2 1.2,0
2706 = smd 2 x 2.6: GND 0,0 | smd 2 x 1.6: IN -3.4,0; OUT 3.4,0
TO92 = drill 0.813 octagon: 1 1.27,0; 2 0,1.905; 3 -1.27,0
TO220 = drill 1.118 long: 1 -2.54,-6.35; 2 0,-6.35; 3 2.54,-6.35 | hole 3.302: 0,11.176
TO220S = drill 1.118 pad 2.184: 1 -2.54,-6.35; 2 0,-6.35; 3 2.54,-6.35
HC49U-V = drill 0.813: 1 -2.413,0; 2 2.413,0
I-PAK_TO251AS = drill 0.889 long: 1 -2.286,-0.254; 2 0,-0.254; 3 2.286,-0.254
0207/10 = drill 0.813 octagon: 1 -5.08,0; 2 5.08,0
M1206 = smd 1.6 x 2: 1 -1.4,0; 2 1.4,0
M0805 = smd 1.3 x 1.6: 1 -0.95,0; 2 0.95,0
RN-9 = drill 0.813 long: 1 -10.16,0; 2 -7.62,0; 3 -5.08,0; 4 -2.54,0; 5 0,0; 6 2.54,0; 7 5.08,0; 8 7.62,0; 9 10.16,0
B3F-10XX = drill 1.016 long: 1 -3.251,2.261; 2 3.251,2.261; 3 -3.251,-2.261; 4 3.251,-2.261
MTG1/2" = drill 1.1 pad 1.93 octagon: P$1 0,0; P$2 -3.81,3.81 | hole 1.4: 3.81,3.81; -3.81,-3.81
F/CM12P = drill 1.016 pad 2.54 octagon: + 3.81,0; - -3.81,0
SJ = smd 1.168 x 1.6: 1 -0.762,0; 2 0.762,0
ML10 = drill 0.914 octagon: 1 -5.08,-1.27; 2 -5.08,1.27; 3 -2.54,-1.27; 4 -2.54,1.27; 5 0,-1.27; 6 0,1.27; 7 2.54,-1.27; 8 2.54,1.27; 9 5.08,-1.27; 10 5.08,1.27
ML14 = drill 0.914 octagon: 1 -7.62,-1.27; 2 -7.62,1.27; 3 -5.08,-1.27; 4 -5.08,1.27; 5 -2.54,-1.27; 6 -2.54,1.27; 7 0,-1.27; 8 0,1.27; 9 2.54,-1.27; 10 2.54,1.27; 11 5.08,-1.27; 12 5.08,1.27; 13 7.62,-1.27; 14 7.62,1.27
E_DOG-M_DISPLAY = drill 0.8 long: 1 -24.13,-13.97; 2 -21.59,-13.97; 19 21.591,-13.97; 20 24.131,-13.97; 21 24.131,13.97; 22 21.591,13.97; 23 19.051,13.97; 24 16.511,13.97; 25 13.971,13.97; 26 11.431,13.97; 27 8.89,13.97; 28 6.351,13.97; 29 3.81,13.97; 30 1.27,13.97; 31 -1.27,13.97; 32 -3.81,13.97; 33 -6.35,13.97; 34 -8.89,13.97; 35 -11.43,13.97; 36 -13.97,13.97; 37 -16.51,13.97; 38 -19.05,13.97; 39 -21.59,13.97; 40 -24.13,13.97
AKL182-02-NO = drill 1.5 pad 2.184 long: P$1 -1.75,0; P$2 1.75,0

### Placement (x,y rotation side)
C1  69.85,88.58 270 top
C2  69.85,80.96 90 top
C3  14.29,82.55 180 top
C4  28.89,43.5 90 top
C5  26.35,34.61 180 top
C6  88.27,46.67 315 top
C7  5.4,59.05 90 top
C8  5.4,64.77 180 top
C9  75.88,44.13 135 top
C10  78.11,30.48 45 top
C11  90.49,31.75 180 top
C12  91.44,128.27 180 bottom
C13  85.72,128.27 180 bottom
C14  99.06,47.94 180 top
C15  99.06,45.4 180 top
C16  99.06,42.86 180 top
C17  99.06,40.32 180 top
C18  99.06,37.78 180 top
C19  99.06,35.24 180 top
C20  99.06,32.7 180 top
C21  99.06,30.16 180 top
C22  68.58,28.89 270 top
C23  71.44,27.62 270 top
C24  74.3,26.67 270 top
C25  102.23,52.7 0 top
C26  90.49,29.53 180 top
C27  83.5,27.94 270 top
C28  99.06,27.62 180 top
C29  104.46,20 0 top
C31  4.76,79.38 90 top
C32  89.53,62.55 270 top
C33  89.53,67.31 90 top
C34  99.69,70.17 0 top
C35  143.83,80.33 90 bottom
C36  142.88,88.58 270 bottom
C41  93.66,46.99 225 top
C42  62.87,129.86 0 bottom
C43  99.69,74.3 180 top
C44  67.31,16.19 180 top
C45  33.66,44.77 180 top
C46  76.2,77.79 0 top
C47  78.11,86.68 270 top
C48  146.69,40.32 90 top
C49  136.21,41.27 180 bottom
C50  139.06,26.35 0 top
C51  137.79,47.94 270 bottom
C52  146.69,57.78 90 top
C53  134.3,51.44 180 bottom
C54  129.86,29.21 90 top
CH1-OUT1  149.54,6.35 90 top
CH1-OUT2  149.54,18.41 90 top
CH2-OUT1  149.54,30.16 90 top
CH2-OUT2  149.54,38.73 90 top
CH3-OUT1  149.54,47.31 90 top
CH3-OUT2  149.54,55.88 90 top
D1  103.82,92.39 90 top
D2  146.69,32.7 270 top
D4  146.69,49.85 270 top
H1  96.97,96 0 top
H2  96.97,4 0 top
H3  141.1,96 0 top
H4  141.1,4 0 top
H5  8.57,117.16 90 top
H6  127.95,117.16 90 top
IC1  84.27,38.6 225 top
IC2  99.69,61.59 270 top
IC3  11.11,75.56 270 top
IC4  134.3,46.35 0 bottom
IC5  19.68,40.64 90 top
J1  150.81,87.31 90 top
J2  105.41,74.3 90 top
J11  105.41,15.24 90 top
JP1  155.89,67.31 270 top
JP2  72.39,10.79 90 top
JP3  111.76,83.19 270 top
JP4  126.05,21.27 90 top
JP5  126.05,82.55 90 top
JP6  81.92,21.27 90 top
JP7  111.76,39.05 270 top
JP8  111.76,61.91 270 top
JP9  81.92,82.55 90 top
KK1  42.23,74.93 180 top
L4  93.98,24.77 90 top
NFE1  75.25,83.82 270 top
Q1  141.6,12.7 180 top
Q4  137.48,37.78 90 top
Q7  141.6,20.95 180 top
Q8  39.69,77.47 45 top
Q10  31.75,126.36 0 bottom
Q11  20,17.78 270 top
Q13  85.41,64.77 270 top
Q14  15.56,65.41 180 top
Q15  139.7,74.61 0 top
Q16  137.48,55.88 90 top
Q17  139.7,70.01 0 top
Q18  139.7,65.41 0 top
R1  16.83,74.3 270 top
R2  11.75,60.33 90 top
R3  9.84,68.58 180 top
R4  19.68,55.24 0 top
R5  9.21,60.33 270 top
R6  2.22,71.75 270 top
R7  9.21,85.09 0 top
R8  92.08,65.09 90 top
R9  61.59,26.35 0 top
R10  61.59,28.89 0 top
R11  61.59,31.43 0 top
R12  138.75,37.78 180 bottom
R13  138.75,55.88 180 bottom
R14  135.25,10.79 180 top
R15  135.25,19.05 180 top
R16  133.35,55.88 180 bottom
R18  39.05,122.24 270 bottom
R19  33.97,131.44 180 bottom
R20  131.76,74.93 90 top
R21  128.27,69.85 90 top
R22  124.78,69.85 90 top
R23  133.35,37.78 180 bottom
R24  136.21,27.3 90 top
R25  133.03,26.04 0 top
R26  133.03,28.26 0 top
R27  126.36,27.94 0 top
R28  65.72,20.95 0 top
R29  67.31,18.41 0 top
R30  63.18,23.5 0 top
R31  90.49,52.7 0 top
R32  26.67,12.7 270 top
R36  49.53,17.14 180 top
R37  49.53,19.68 180 top
R38  93.66,18.41 0 top
RN1  102.55,37.78 90 top
S1  30.8,117.16 45 top
S2  105.73,117.16 135 top
S3  30.8,117.16 0 top
S4  105.73,117.16 90 top
SG1  9.21,19.05 180 top
SJ1  88.27,26.04 0 bottom
SV1  52.07,10.79 180 top
SV2  68.26,123.83 0 bottom
SV3  41.27,38.42 90 top
U$1  68.26,119.06 0 top
X1  108.27,93.66 90 top

### Tracks (layer width: path | path; a pad name or v marks a point on that pad's centre or on a via)
+3V3  (via drill 0.6)
  Top 0.305: C10.1 77.54,29.77 78.11,29.21 78.74,29.21 80.33,30.8 80.33,31.27 IC1.31 83.03,33.97 84.45,33.97 | C9.1 77.47,42.55 78.06,42.55 IC1.19 82.55,38.06 82.55,36.83 82.87,36.51 82.87,36.04 83.82,35.08 83.82,34.61 84.45,33.97 | R38.2 99.38,18.41 | 103.5,17.78 103.46,17.83 | 84.45,33.97 84.45,35.24 84.77,35.56 84.77,37.15 84.45,37.47 84.45,41.27 86.04,42.86 86.04,43.77 IC1.9 87.31,45.04 87.31,46.99 87.56,47.23 C6.1
  Top 0.61: IC2.17 99.69,63.5 97.16,66.04 97.16,67.31 | 97.16,67.31 C34.1 | 97.16,67.31 IC2.1 93.34,67.31 92.08,68.58 R8.2 | 84.45,34.12 84.45,33.97 84.45,33.02 84.3,32.86 84.3,30.48 83.5,29.69 C27.1 84.09,28.94 85.09,27.94 v85.09,20 85.09,17.46 83.82,16.19 C44.1 | JP2.2 68.58,8.26 68.26,8.57 68.26,14.61 | 99.38,18.41 100.01,17.78 103.5,17.78 J11.1 | 103.46,17.83 C29.1 | C6.1 85.41,49.53 R31.1 | L4.1 93.98,21.27 96.84,18.41 R38.2 | C44.1 68.26,16.19 68.26,14.61 | C44.1 68.26,16.24 | 62.23,14.61 46.99,14.61 R36.2 | 62.23,14.61 68.26,14.61 | R30.1 R28.1 60.64,20 R29.1 62.23,14.61
  Bottom 0.305: SV3.11 41.27,42.23 26.67,42.23
  Bottom 0.61: IC5.OUT 26.04,43.18 26.67,42.55 26.67,42.23 26.67,37.15 27.62,36.2 27.62,34.86 C5.+ 27.62,34.61 27.62,30.16 38.1,19.68 R37.2 R36.2 46.99,17.14 49.53,14.61 SV1.7 SV1.8 | R38.2 91.44,18.41 89.85,20 v85.09,20 | R31.1 88.27,52.7 89.85,54.29 89.85,59.37 90.81,60.33 90.81,60.96 92.08,62.23 R8.2
+5V  (via drill 0.6)
  Top 0.61: 34.61,44.77 34.61,41.59 33.97,40.96 C4.1 28.89,39.05 27.94,38.1 IC5.IN | 34.61,44.77 34.61,46.67 38.1,50.16 57.47,50.16 66.67,59.37 66.67,66.99 v75.25,75.56 75.25,77.79 | 34.61,44.77 C45.+ | 75.25,77.79 NFE1.OUT | JP3.1 106.68,85.72 v101.6,80.64 | 75.25,77.79 C46.1
  Bottom 0.61: C4.1 SV3.10 | SG1.+ 5.4,28.89 8.57,32.07 17.46,32.07 IC5.IN | v101.6,80.64 90.81,80.64 85.72,75.56 v75.25,75.56
+5V/1
  Top 0.813: SV2.10 65.72,125.73 64.14,127.32 R18.1
+5V/4
  Top 1.93: JP5.10 JP5.9 129.86,87.63 140.02,87.63 142.24,89.85 C36.+ 145.73,89.85 J1.4
  Bottom 1.93: J1.4 156.21,89.53 156.21,75.88 154.94,74.61 154.94,63.5 153.67,62.23 JP1.10 JP1.9
+12V  (via drill 0.6)
  Top 0.61: v18.1,67.63 18.1,70.8 16.83,72.07 R1.1
  Bottom 0.61: IC3.8 R1.1 C3.1 | Q8.3 45.97,74.68 46.67,73.98 46.67,72.71 42.86,68.9 19.37,68.9 v18.1,67.63 | JP9.5 102.55,82.55 104.46,80.64 JP3.3
  Bottom 1.676: 69.85,80.96 71.75,80.96 73.34,82.55 JP9.6 JP9.5 | Q8.3 52.16,80.96 69.85,80.96 | 69.85,80.96 C2.1
-12V  (via drill 0.6)
  Top 0.305: 143.83,24.77 144.15,24.45
  Top 1.93: JP5.6 JP5.5 139.83,82.55 C35.+
  Top 2.54: C35.+ 147.32,78.55 | 147.32,78.55 149.67,78.55 J1.1 | 147.32,78.55 147,78.23 147,63.5 143.83,60.33 Q16.3 141.92,58.42 140.34,56.83 140.34,52.39 143.83,48.9 v143.83,48.26 Q4.3 141.92,40.32 140.34,38.73 140.34,34.29 143.83,30.8 143.83,24.77 146.05,22.54 146.05,17.14 | CH1-OUT2.2 146.05,17.14 | CH1-OUT1.2 146.05,5.08 146.05,17.14
  Bottom 0.305: 137.78,48.95 C51.1
  Bottom 0.61: IC4.8 137.78,48.95 | C51.1 143.15,48.94 v143.83,48.26
  Bottom 2.54: JP1.8 JP1.6 JP1.4 JP1.2 JP1.1 149.54,78.42 J1.1
AGND  (via drill 0.6)
  Top 0.305: IC1.38 89.49,32.25 C11.2 89.62,31.61 | v89.85,27.62 89.85,29.3 | C28.2 v96.52,27.62 | C15.2 v96.52,45.4 | C16.2 v96.52,42.86 | C17.2 v96.52,40.32 | C18.2 v96.52,37.78 | C19.2 v96.52,35.24 | C20.2 v96.52,32.7 | C21.2 v96.52,30.16 | C41.1 94.61,47.94
  Top 0.61: C41.1 95.25,48.58 v96.52,48.58
  pour Bottom (isolate 0.61, rank 3): 120.02,51.75 99.06,51.75 88.58,41.27 88.58,25.4 120.02,25.4
  pour Top (isolate 0.61, rank 3): 120.02,51.75 99.06,51.75 88.58,41.27 88.58,25.4 120.02,25.4
GND  (via drill 0.6)
  Top 0.305: J11.3 107,12.7 107.95,13.65 107.95,19.05 107,20 C29.2 | C10.2 79.11,31.19 IC1.30 82.55,34.62 v82.55,34.92 | IC2.20 102.87,67.31 102.23,67.94 C34.2 | C9.2 75.32,44.84 75.88,45.4 76.34,45.4 IC1.18 80.78,40.96 80.96,40.96 | 85.41,38.73 85.41,39.69 85.09,40.01 85.09,40.96 86.68,42.55 86.68,43.27 IC1.8 88.17,44.77 88.27,44.77
  other vias: 81.92,25.72 83.82,36.51 86.68,36.2 86.04,85.09 87.63,85.09 90.17,77.79 91.44,79.06 64.45,16.19 78.11,80.01 69.85,74.93 67.94,47.31 74.3,35.24 72.71,35.24 71.12,35.24 76.83,24.13 76.83,18.1 64.45,12.7
  pour Bottom (isolate 0.406, rank 4): 0,100.33 0,0 120.33,0 120.33,100.33
  pour Top (isolate 0.406, rank 4): 0,100.33 0,0 120.33,0 120.33,100.33
GNDA  (via drill 0.6)
  other vias: 66.99,112.08 66.99,113.35 66.99,116.52 66.99,117.79
  pour Bottom (isolate 0.406): -0.32,101.6 -0.32,137.16 136.53,137.16 136.53,101.6
  pour Top (isolate 0.406): 0,101.92 0,137.16 136.53,137.16 136.53,101.92
GNDIO
  pour Bottom (isolate 0.406): 121.92,100.33 164.47,100.33 164.47,0 121.92,0
  pour Top (isolate 0.406): 121.92,100.33 164.15,100.33 164.15,0 121.92,0
LED1
  Bottom 1.168: Q18.2 139.7,64.45 141.29,62.87 143.19,62.87 145.1,64.77 JP1.7
LED2
  Bottom 1.168: Q17.2 139.7,68.74 140.97,67.47 149.38,67.47 JP1.5
LED3
  Bottom 1.168: Q15.2 139.7,73.34 140.97,72.07 145.73,72.07 147.96,69.85 JP1.3
N$1
  Bottom 0.61: R7.2 21.91,85.09 29.21,77.79 39.37,77.79 42.23,74.93
  Bottom 1.676: X1.P$1 106.21,89.85 103.82,89.85 | 103.82,89.85 C1.+ 54.93,89.85 42.23,77.15 42.23,74.93 Q8.2 | 103.82,89.85 D1.C
N$2
  Bottom 0.61: IC3.6 IC3.7
N$3
  Top 0.61: C52.1 146.69,55.88
  Top 1.778: CH3-OUT1.2 147.64,47.31 146.69,48.26 D4.C 146.69,55.88 | Q16.2 146.69,55.88 | 146.69,55.88 CH3-OUT2.2
  Bottom 0.61: R13.2 Q16.2
N$4
  Top 0.61: JP4.6 124.78,27.3 R27.1
N$5
  Bottom 0.61: JP3.2 109.54,83.19 110.81,81.92 110.81,77.47 107.63,74.3 J2.2 C43.1
N$6
  Bottom 0.61: R12.1 R23.2 134.62,37.91 134.62,38.73 133.67,39.69 IC4.3
N$7
  Bottom 0.61: C7.+ 5.4,57.47 7.62,55.24 R5.2 10.79,56.83 13.02,56.83 R4.1
N$8
  Bottom 0.305: 138.75,35.88 138.75,39.69
  Bottom 0.61: IC4.1 136.21,42.86 137.16,41.91 137.16,41.32 C49.2 138.75,39.73 138.75,39.69 | Q4.1 139.38,35.24 138.75,35.88
N$9
  Top 0.305: 126.05,20 129.22,20
  Top 0.61: JP4.2 126.05,20 | 129.22,20 130.18,19.05 R15.2 R14.2
N$10
  Bottom 0.61: Q14.3 R1.2 18.8,71.18 Q8.1
N$11
  Top 0.305: JP4.4 126.05,22.54 126.05,25.4 126.68,26.04
  Top 0.61: 126.68,26.04 R25.1
N$12
  Bottom 0.61: R2.2 Q14.1
N$13
  Bottom 0.61: R5.1 8.57,64.77 C8.+ 6.35,64.83 6.35,68.9 6.03,69.22 6.03,73.03 IC3.3
N$14  (via drill 0.6)
  Top 0.61: JP4.3 136.84,21.27 v138.11,22.54
  Bottom 0.61: v138.11,22.54 138.11,24.13 146.69,32.7 CH2-OUT1.3
N$15  (via drill 0.6)
  Top 0.61: v136.21,23.81 JP4.5
  Bottom 0.61: CH3-OUT1.3 151.45,49.85 152.4,48.9 152.4,35.24 151.76,34.61 146.69,34.61 v136.21,23.81
N$16
  Bottom 0.61: R13.1 R16.2 134.94,55.69 134.94,53.66 134.3,53.02 132.4,53.02 131.44,52.07 131.44,49.21 131.7,48.95 IC4.5
N$17  (via drill 0.6)
  Top 0.305: IC1.34 86.04,31.17 86.04,15.56 85.09,14.61 v83.82,14.61
  Bottom 0.61: v83.82,14.61 77.47,8.26 JP2.1
N$18  (via drill 0.6)
  Top 0.61: R24.2 136.21,41.91 v138.75,44.45
  Bottom 0.61: C49.1 134.94,41.55 IC4.2 134.94,45.4 135.25,45.72 137.48,45.72 v138.75,44.45
N$19
  Top 0.61: Q1.2 R14.1
N$20
  Top 0.61: C48.1 146.69,38.73
  Top 1.778: D2.C Q4.2 | CH2-OUT1.2 147.64,30.16 146.69,31.11 D2.C | CH2-OUT2.2 146.69,38.73 D2.C
  Bottom 0.61: Q4.2 R12.2
N$21
  Top 0.61: Q7.2 R15.1
N$22
  Bottom 0.61: CH1-OUT1.4 145.41,10.16 Q1.3
N$23
  Top 0.305: IC1.35 86.68,31.67 86.68,14.92 85.09,13.34
  Top 0.61: JP2.5 85.09,13.34
N$24
  Bottom 0.61: IC4.7 134.94,51.07 C53.2 137.21,53.34 Q16.1
N$25
  Bottom 0.61: CH1-OUT2.4 144.15,22.23 Q7.3
N$27
  Top 0.813: R18.2 39.05,110.17 U$1.1 | U$1.20 92.39,106.36 91.12,107.63 45.4,107.63 44.13,106.36 U$1.1 | U$1.1
N$28
  Bottom 0.813: U$1.19 U$1.2 46.67,113.98 34.29,126.36 Q10.3
N$29
  Bottom 0.61: R19.1 30.48,131.44 31.75,130.18 Q10.2
N$30
  Top 0.61: U$1.22 89.85,128.84 C12.+
N$31
  Top 0.61: U$1.21 92.39,128.33 C12.-
N$32
  Top 0.61: U$1.24 84.77,128.33 C13.+
N$33
  Top 0.305: C14.1 100.06,47.35 99.38,46.67 95.73,46.67 IC1.3
  Top 0.61: JP7.1 RN1.9 C14.1
N$34
  Top 0.305: C15.1 100.06,44.81 99.38,44.13 94.32,44.13 IC1.2
  Top 0.61: JP7.3 RN1.8 C15.1
N$35
  Top 0.305: C16.1 100.06,42.27 99.38,41.59 92.92,41.59 IC1.1
  Top 0.61: JP7.5 RN1.7 C16.1
N$36
  Top 0.305: C17.1 100.06,39.73 99.38,39.05 92.92,39.05 IC1.44
  Top 0.61: JP7.7 RN1.6 C17.1
N$37
  Top 0.305: C18.1 100.06,37.2 99.38,36.51 92.39,36.51 91.76,35.88 91.52,35.88 IC1.43
  Top 0.61: JP7.9 RN1.5 C18.1
N$38
  Top 0.305: C19.1 100.06,34.66 99.38,33.97 94.93,33.97 93.98,34.92 91.34,34.92 IC1.42
  Top 0.61: JP7.11 RN1.4 C19.1
N$39
  Top 0.305: IC1.41 90.84,34.29 93.34,34.29 96.2,31.43 99.38,31.43 100.06,32.12 C20.1
  Top 0.61: C20.1 RN1.3 JP7.13
N$40
  Top 0.305: IC1.40 90.35,33.66 92.71,33.66 94.61,31.75 94.61,30.16 95.89,28.89 99.38,28.89 100.06,29.57 C21.1
  Top 0.61: C21.1 RN1.2 JP7.15
N$41  (via drill 0.6)
  Top 0.61: v127.32,16.19 JP4.1
  Bottom 0.61: CH1-OUT1.3 144.46,7.62 143.51,8.57 134.94,8.57 v127.32,16.19
N$42
  Bottom 0.61: SG1.- Q11.3
N$43
  Bottom 0.61: Q11.2 R32.1
N$45
  Top 0.61: R22.2 JP5.2
N$46
  Top 0.61: R21.2 128.27,76.52 JP5.1
N$47
  Top 0.61: JP5.3 R20.2
N$48
  Top 0.61: JP9.9 JP9.10 78.11,87.63 | NFE1.IN 75.25,87.63 78.11,87.63 | 78.11,87.63 C47.1
N$49
  Bottom 0.305: 15.56,64.77 15.56,66.04
  Bottom 0.61: Q14.2 15.56,64.77 | 15.56,66.04 15.56,67.94 R3.1
N$50
  Bottom 0.305: 6.35,75.56 8.26,75.56
  Bottom 0.61: C31.2 IC3.1 8.89,77.79 8.89,76.2 8.26,75.56 | R3.2 4.76,73.98 6.35,75.56
N$51
  Bottom 0.61: IC3.2 C31.1 3.49,76.83 | R6.1 3.49,76.83 | R7.1 3.49,84.45 3.49,76.83
N$52
  Top 0.61: C50.1 R24.1 134.3,26.36 R25.2
N$53  (via drill 0.6)
  Top 0.61: R26.2 133.98,43.5 v130.49,46.99
  Bottom 0.61: C53.1 133.67,51.07 IC4.6 133.67,47.31 133.35,46.99 v130.49,46.99
N$54
  Top 0.61: R27.2 129.59,27.94 C54.1 129.91,28.26 R26.1
N$62
  Top 0.305: S1.2 31.52,121.06
  Top 0.61: 29.2,118.76 S1.2 | S1.1 29.2,118.76 | 29.2,118.76 S3.P$2 | 31.52,121.06 33.97,123.51 43.18,123.51 51.75,114.94 68.26,114.94 SV2.1
N$63
  Top 0.61: 104.13,115.56 S2.2 94.59,125.09 SV2.2 | 104.13,115.56 S2.1 | 104.13,115.56 S4.P$2
N$64
  Bottom 0.305: 72.07,126.68 72.07,123.83 SV2.3
  Bottom 0.61: U$1.31 66.99,131.76 72.07,126.68
N$65
  Bottom 0.305: U$1.30
  Bottom 0.61: SV2.4 73.34,127.32 69.53,131.13 U$1.30
N$66
  Top 0.305: 69.53,126.05 69.53,123.83 SV2.5
  Top 0.61: U$1.29 72.07,128.59 69.53,126.05
N$67
  Top 0.61: U$1.28 74.61,128.91 SV2.6
N$68  (via drill 0.6)
  Top 0.61: v65.72,130.18 55.88,130.18 54.29,131.76 U$1.36
  Bottom 0.305: 66.99,128.91 66.99,123.83 SV2.7
  Bottom 0.61: v65.72,130.18 66.99,128.91
N$69
  Top 0.305: U$1.39
  Top 0.61: SV2.8 68.26,126.05 65.72,128.59 49.21,128.59 46.67,131.13 U$1.39
N$70
  Bottom 0.61: R19.2 53.98,116.52 63.18,116.52 65.72,119.06 SV2.9
N$71
  Top 0.305: IC1.39 89.85,33.02 91.12,33.02 91.49,32.66 C11.1
  Top 0.406: L4.2 93.98,26.04
  Top 0.61: RN1.1 C28.1 100.06,27.04 99.06,26.04 93.98,26.04 | L4.2 93.98,28.17 92.62,29.53 C26.1 C11.1
N$72
  Top 0.305: R9.1 60.96,26.35 63.82,23.5 R30.2
  Bottom 0.305: JP6.5 81.92,22.54 69.22,22.54 R30.2
N$73
  Top 0.61: IC2.3 90.49,64.77 C32.1
  Bottom 0.61: Q13.2 86.87,63.82 C32.1
N$77
  Top 0.61: C33.1 IC2.2
  Bottom 0.61: Q13.1 86.55,66.04 C33.1
N$78
  Bottom 0.305: JP6.3 81.92,20 79.38,20 78.42,20.95 R28.2 66.36,20.95 58.42,28.89 R10.1
N$79
  Top 0.61: IC2.18 107,64.77 107.31,64.45 JP8.2
N$80
  Top 0.305: 105.73,66.04 106.05,65.72 109.54,65.72 110.17,65.09 110.17,63.5
  Top 0.61: 105.73,66.04 IC2.19 | 110.17,63.5 108.58,61.91 JP8.3
N$81
  Top 0.61: IC2.4 92.71,63.5 92.08,62.87 R8.1
N$82
  Top 0.61: Q15.1 136.27,74.36 R20.1
N$83
  Top 0.61: R21.1 129.86,64.77 134.84,69.75 Q17.1
N$84
  Top 0.61: R22.1 126.36,63.18 129.86,63.18 131.76,65.09 137.35,65.09 Q18.1
N$85
  Top 0.305: R11.1 58.1,31.43 64.77,24.77 68.9,24.77 72.39,21.27 R29.2
  Bottom 0.305: JP6.1 81.92,17.46 80.01,17.46 77.79,19.68 73.66,19.68 R29.2
PB0  (via drill 0.6)
  Top 0.305: 89.52,41.57 IC1.4 | 89.52,41.57 92.39,44.45 92.39,45.72 C41.2 | 89.52,41.57 88.58,40.64 v88.58,38.73
  Top 0.61: v56.2,34.61 51.44,34.61 v50.48,33.66
  Bottom 0.305: v88.58,38.73 87.63,37.78 56.52,37.78 56.2,37.47 v56.2,34.61
  Bottom 0.61: v50.48,33.66 50.48,30.48 49.21,29.21 41.59,29.21 SV3.2
PB1
  Top 0.305: IC1.5 90.49,43.69 90.49,46.99 95.57,52.07 R31.2
  Top 0.61: J2.1 109.54,76.83 111.12,75.25 111.12,55.88 109.22,53.98 98.74,53.98 97.47,52.7 R31.2
  Bottom 0.61: R31.2 C25.1
PB2  (via drill 0.6)
  Top 0.305: IC1.6 87.63,41.96 87.63,40.01 v86.68,39.05
  Top 0.61: v51.44,41.91 54.93,41.91 v58.1,38.73
  Bottom 0.305: v86.68,39.05 86.36,38.73 v58.1,38.73 | 48.26,38.42 51.44,41.59 v51.44,41.91
  Bottom 0.61: SV3.7 48.26,38.42
PB3  (via drill 0.6)
  Top 0.305: IC1.7 87.31,42.78 87.31,42.55 v86.36,40.64
  Top 0.61: v52.39,43.18 56.2,43.18 v59.37,40.01
  Bottom 0.305: v86.36,40.64 85.72,40.01 v59.37,40.01 | SV3.8 41.27,39.69 48.26,39.69 50.16,41.59 50.16,42.86 50.48,43.18 v52.39,43.18
PC0  (via drill 0.6)
  Top 0.305: IC1.10 85.41,44.27 85.41,43.18 v83.19,40.96
  Bottom 0.305: v83.19,40.96 58.42,40.96 54.61,37.15
  Bottom 0.61: 54.61,37.15 54.61,24.77 58.74,20.64 58.74,17.14 | 58.74,17.14 58.74,11.11 SV1.2 | 58.74,17.14 R36.1
PC1  (via drill 0.6)
  Top 0.305: IC1.11 84.45,44.45 v84.45,43.81
  Bottom 0.305: v84.45,43.81 84.45,42.55 83.82,41.91 58.1,41.91 53.34,37.15 | 53.34,13.02 53.34,10.79 SV1.4
  Bottom 0.61: 53.34,19.68 53.34,37.15 | 53.34,19.68 R37.1 | 53.34,13.02 53.34,19.68
PC2  (via drill 0.6)
  Top 0.305: IC1.12 v83.82,46.36 v83.82,46.35
  Bottom 0.305: v83.82,46.35 81.28,43.81 57.47,43.81 46.99,33.34
  Bottom 0.61: SV3.3 46.99,33.34
PC3  (via drill 0.6)
  Top 0.305: IC1.13 83.19,44.21 v83.19,42.86
  Bottom 0.305: v83.19,42.86 57.78,42.86 46.99,32.07 41.27,32.07 SV3.4
PC4  (via drill 0.6)
  Top 0.305: IC1.14 80.96,45.3 80.96,46.04
  Top 0.61: v82.23,47.31 80.96,46.04
  Bottom 0.305: v82.23,47.31 79.69,44.77 57.15,44.77 48.26,35.88
  Bottom 0.61: SV3.5 48.26,35.88
PC5  (via drill 0.6)
  Top 0.305: 79.69,45.44 IC1.15
  Top 0.61: v79.69,46.67 79.69,45.44
  Bottom 0.305: v79.69,46.67 78.74,45.72 56.83,45.72 48.26,37.15 41.27,37.15 SV3.6
PC6  (via drill 0.6)
  Top 0.305: 78.42,45.58 IC1.16
  Top 0.61: v78.42,55.88 IC2.10 | 78.42,45.58 v78.42,53.02
  Bottom 0.61: v78.42,53.02 v78.42,55.88
PC7
  Top 0.305: IC1.17 77.15,45.72
  Top 0.61: IC2.12 99.06,57.15 96.52,54.61 78.11,54.61 77.15,53.66 77.15,45.72
PD0
  Top 0.305: IC1.20 77.57,41.91 75.56,41.91
  Top 0.61: JP9.1 83.19,73.03 72.39,62.23 72.39,45.09 75.56,41.91
PD1
  Top 0.305: 81.92,73.66 81.92,78.74 JP9.3 | IC1.21 77.39,40.96 74.93,40.96
  Top 0.61: 81.92,73.66 71.12,62.87 71.12,44.77 74.93,40.96
PD2
  Top 0.61: JP9.2 80.64,74.3 69.85,63.5 69.85,44.45 74.42,39.88 IC1.22
PD3  (via drill 0.6)
  Top 0.305: 76.79,36.83 77.29,37.33 IC1.23
  Top 0.61: v63.82,48.9 75.88,36.83 76.79,36.83
  Bottom 0.61: R4.2 57.47,55.24 v63.82,48.9
PD4  (via drill 0.6)
  Top 0.305: 74.16,33.02 IC1.24
  Top 0.61: 74.16,33.02 52.39,33.02 50.16,30.8 v48.9,30.8
  Bottom 0.61: SV3.1 v48.9,30.8
PD5
  Top 0.305: IC1.25 73.7,31.43 C22.1 R11.2
PD6
  Top 0.305: IC1.26 73.56,30.16 C23.1 67.94,30.16 R10.2
PD7
  Top 0.305: IC1.27 74.3,29.76 C24.1 73.34,28.26 68.58,28.26 R9.2
PE0  (via drill 0.6)
  Top 0.305: IC1.28 81.6,35.93 v81.6,36.2
  Top 0.61: v47.94,40.96 50.16,40.96 54.61,36.51 v57.47,36.51
  Bottom 0.305: v57.47,36.51 81.28,36.51 v81.6,36.2
  Bottom 0.61: SV3.9 v47.94,40.96
PE1
  Top 0.305: JP6.2 78.74,20.64 78.74,25.4 75.88,28.26 75.88,30.16 78.42,32.7 79.5,32.7 IC1.29
PE2
  Top 0.305: JP6.4 80.01,21.27 79.38,21.91 79.38,28.89 80.96,30.48 80.96,30.77 IC1.32
PE3
  Top 0.305: JP6.6 80.64,29.32 IC1.33
PR0
  Top 0.305: IC1.36 87.31,32.17 87.31,13.97
  Top 0.61: 87.31,13.97 76.2,2.86 28.57,2.86 26.67,4.76 R32.2
PR1
  Top 0.305: IC1.37 87.95,32.66 87.95,19.05 R38.1
  Top 0.61: R38.1 88.58,15.88 89.22,15.24 J11.2
V+
  Top 0.61: U$1.23 87.31,128.84 C13.-
  Bottom 0.305: U$1.25 | U$1.32 | U$1.32 | C42.1 64.14,129.86 64.45,129.54 64.45,123.83 SV2.11 | U$1.35
  Bottom 0.61: U$1.40 44.13,134.62 44.77,135.25 56.2,135.25 56.83,134.62 U$1.35 U$1.34 U$1.33 U$1.32 | U$1.23 87.31,134.62 86.68,135.25 82.87,135.25 82.23,134.62 U$1.25 | U$1.25 U$1.26 79.69,134.3 78.74,135.25 65.09,135.25 64.45,134.62 U$1.32 | U$1.32 64.45,129.54

### Text on the board
Top: Top | S1 | S2 | Rev:1.1 | Top | ConFLiCT | Top | ConFLiCT | Rev:2.2 | DFM | 1 | 1 | 3 | 2 | LCD | 1 | 1 | DS18S20 | PDI | Ext. | 1 | Rev:2.1
Bottom: Bot | Bot | Bot